# EAGLE schematic electrosteel2020 (EAGLE 9.2.2)
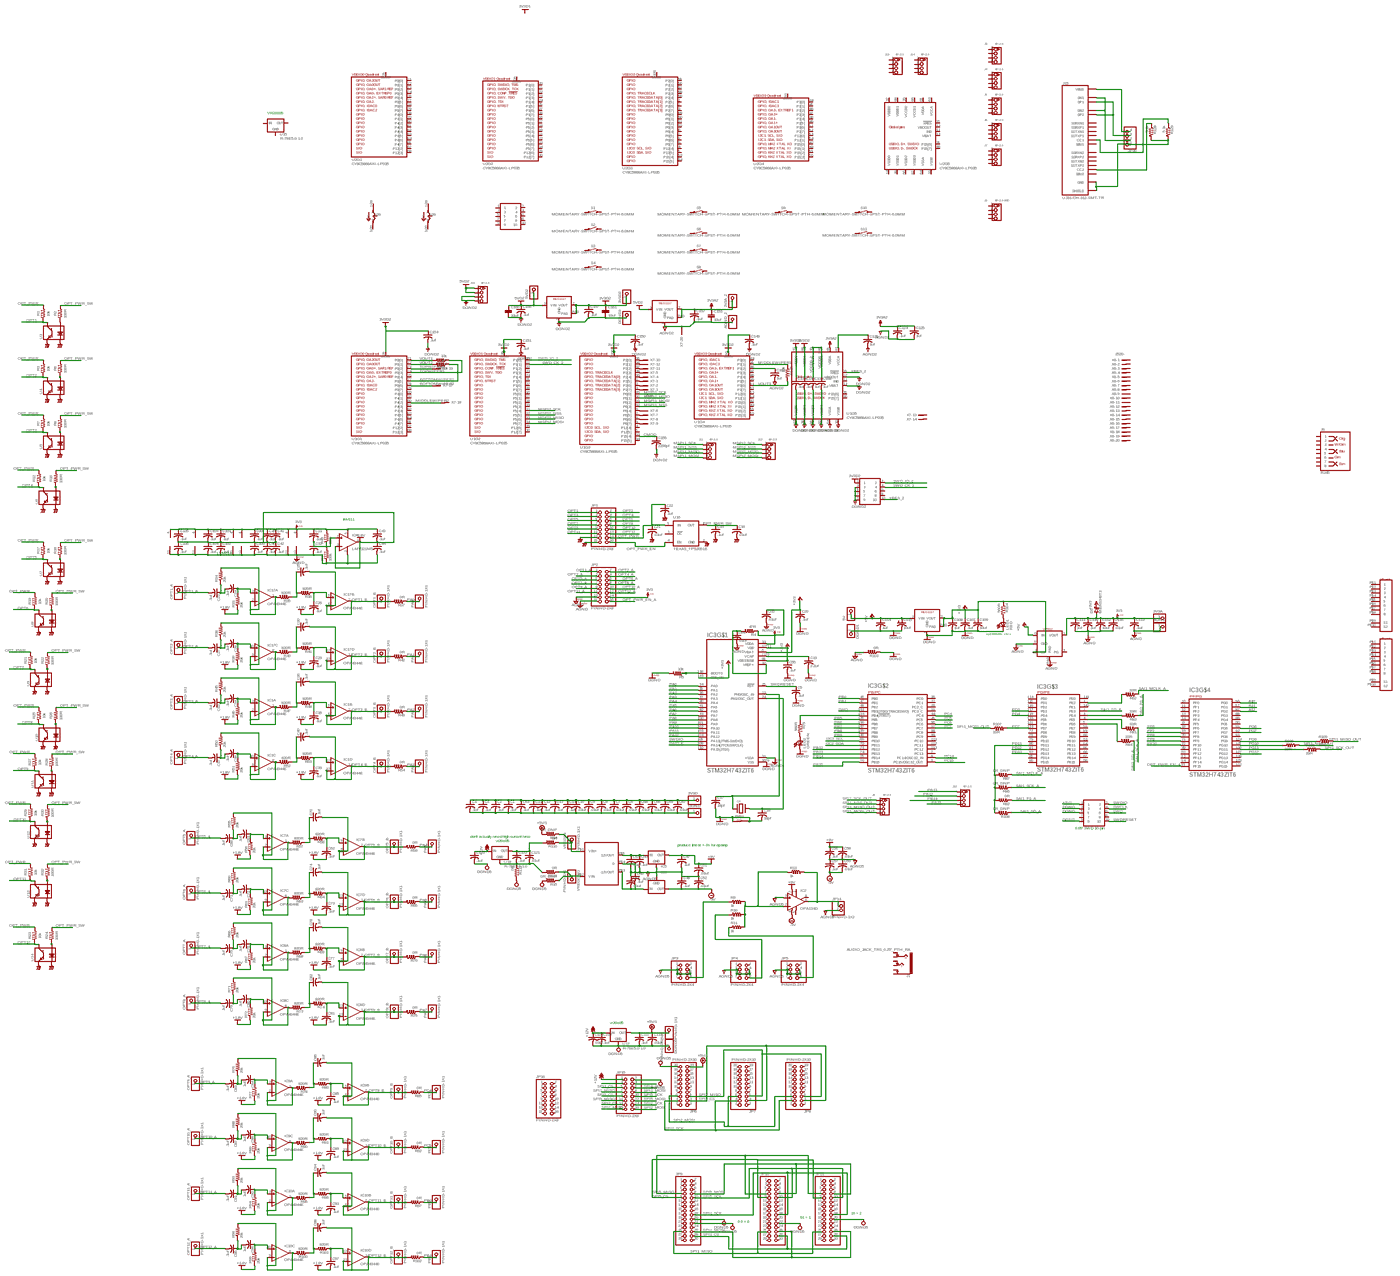
[diagram p0: schematic, sheet 1, overview]
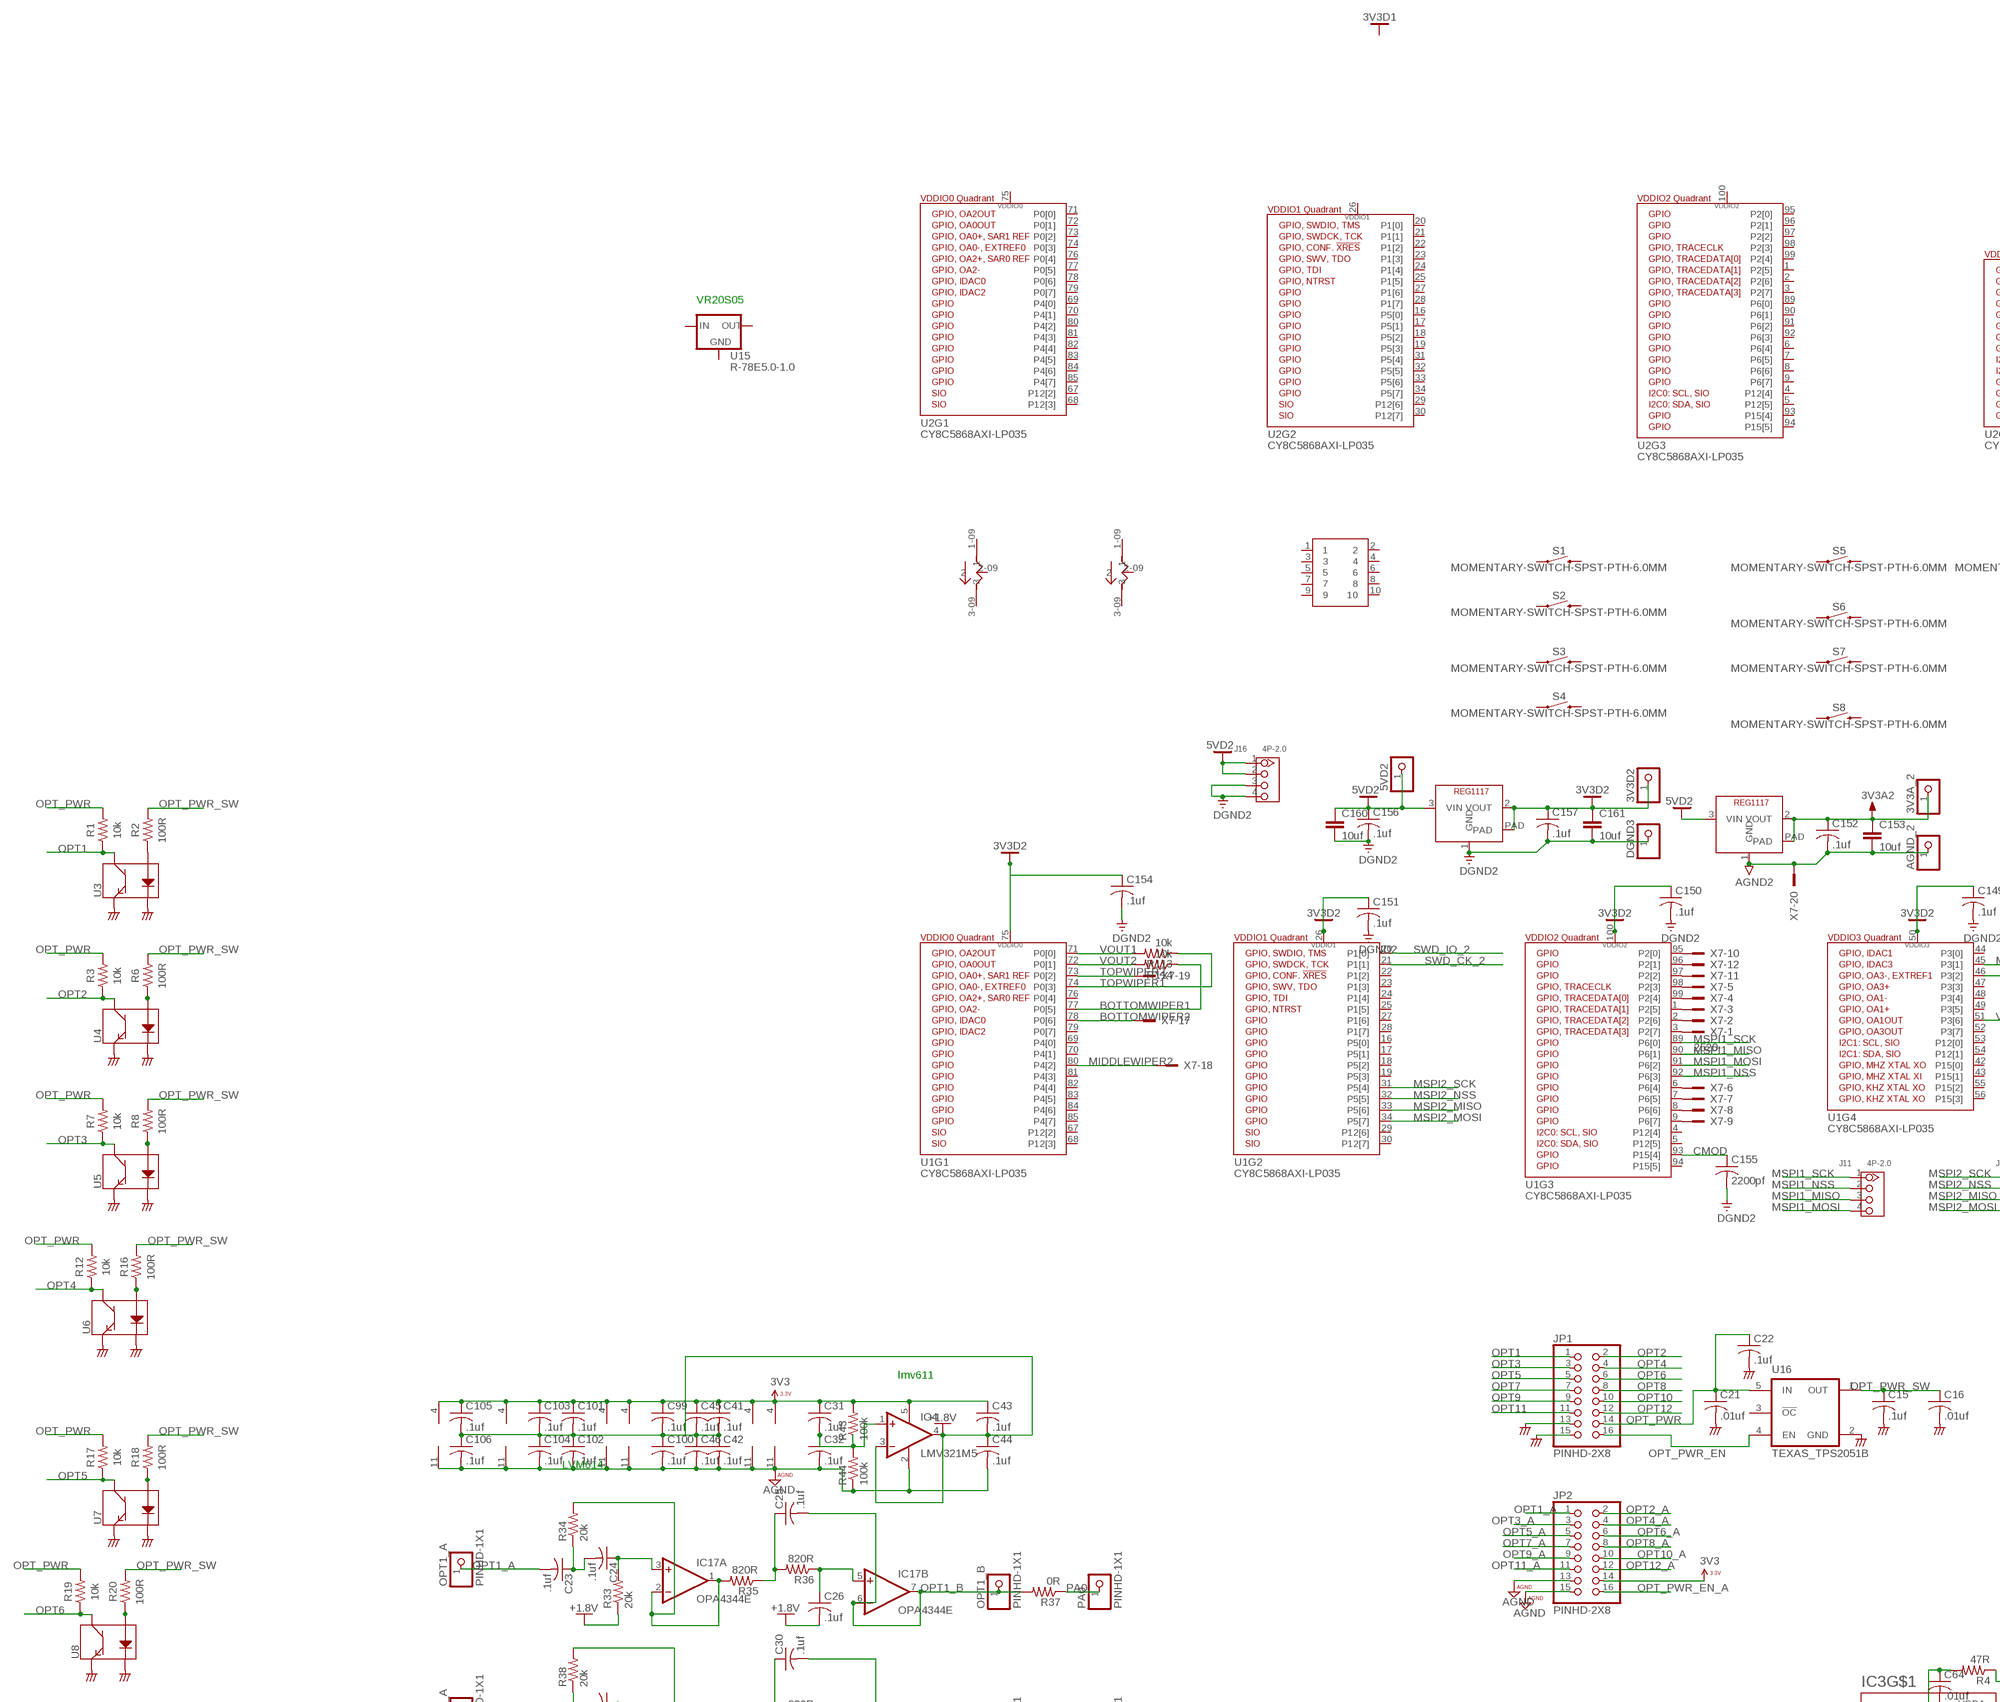
[diagram p1: schematic, sheet 1, part 1 of 4]
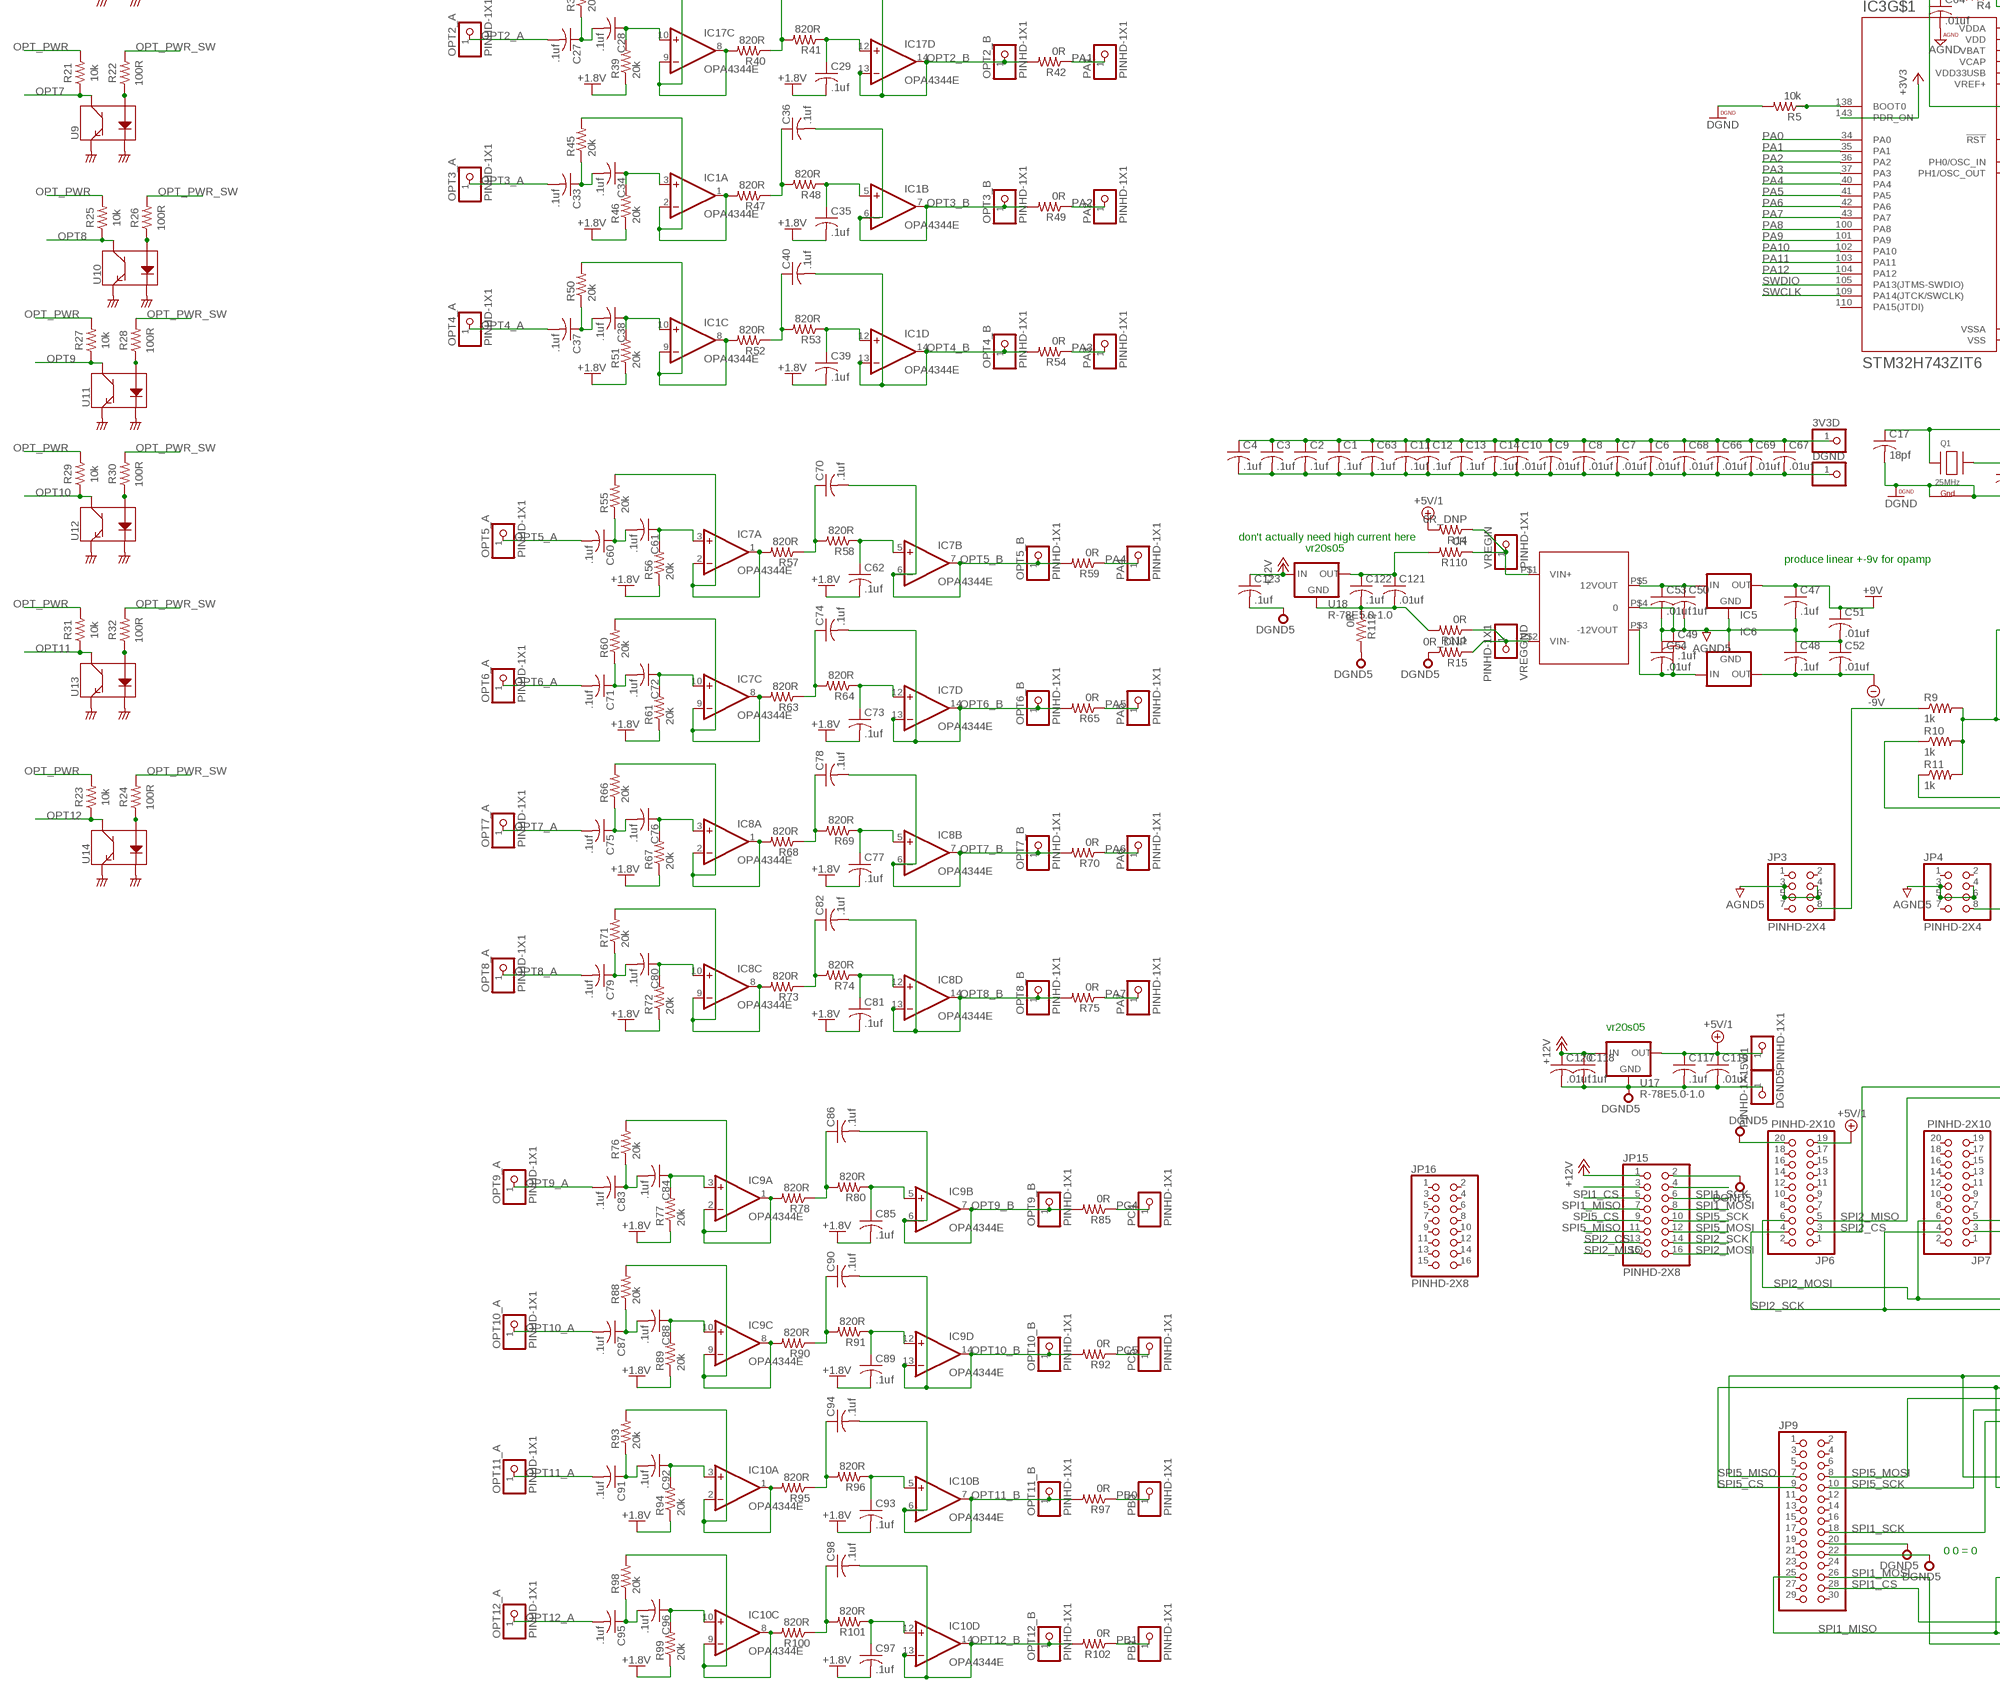
[diagram p2: schematic, sheet 1, part 2 of 4]
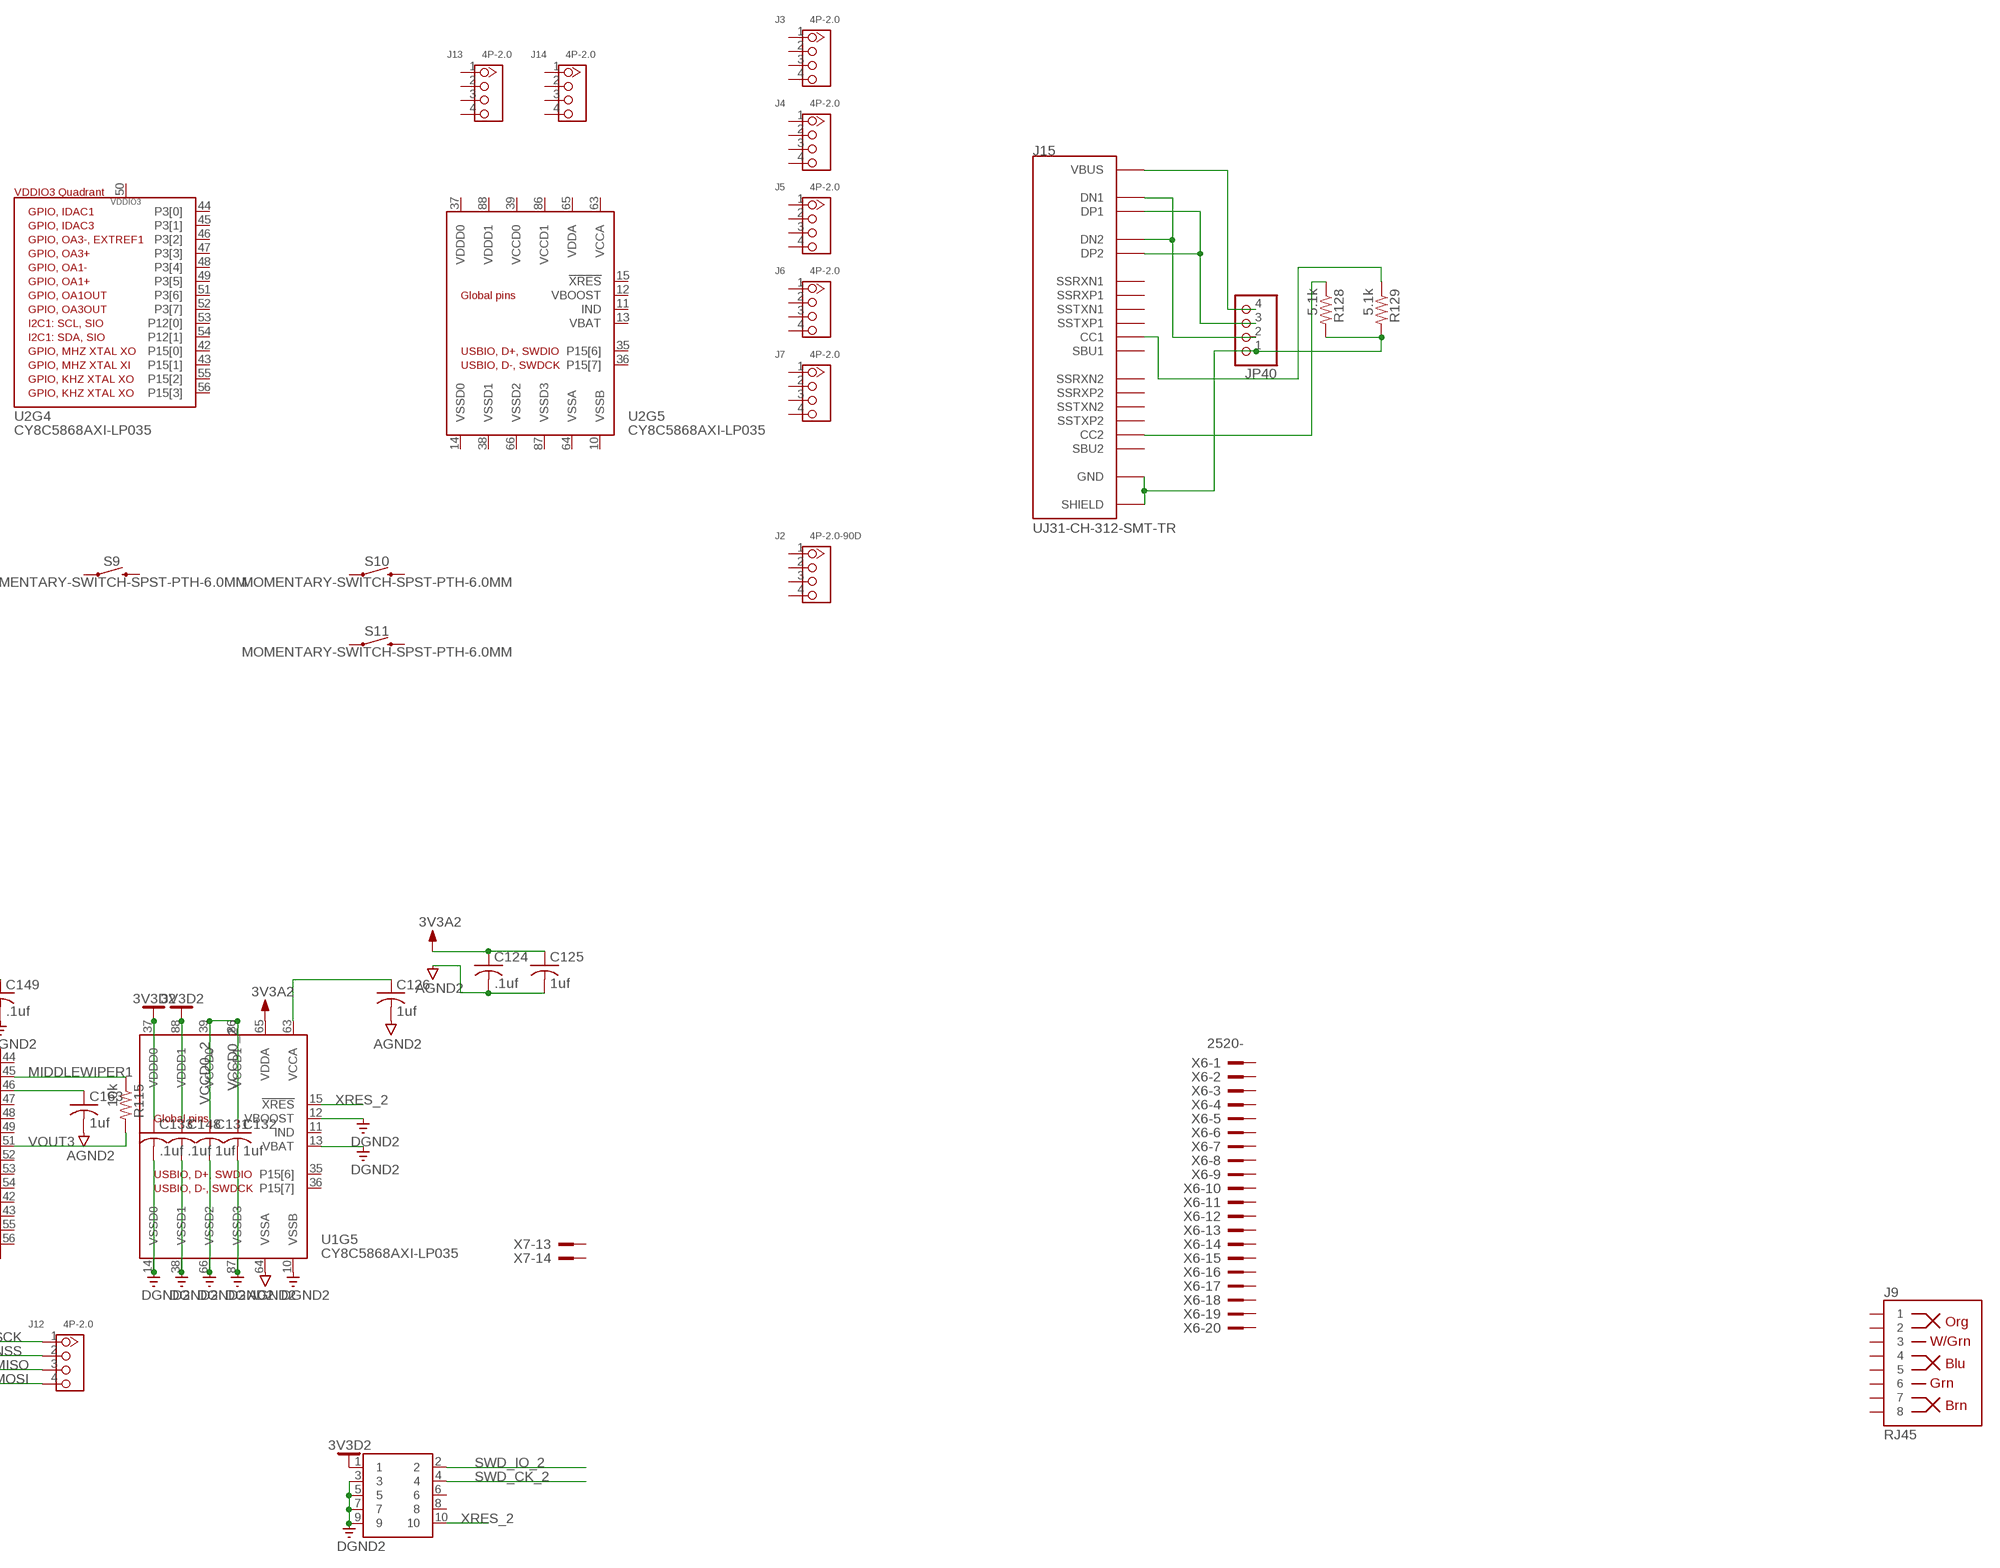
[diagram p3: schematic, sheet 1, part 3 of 4]
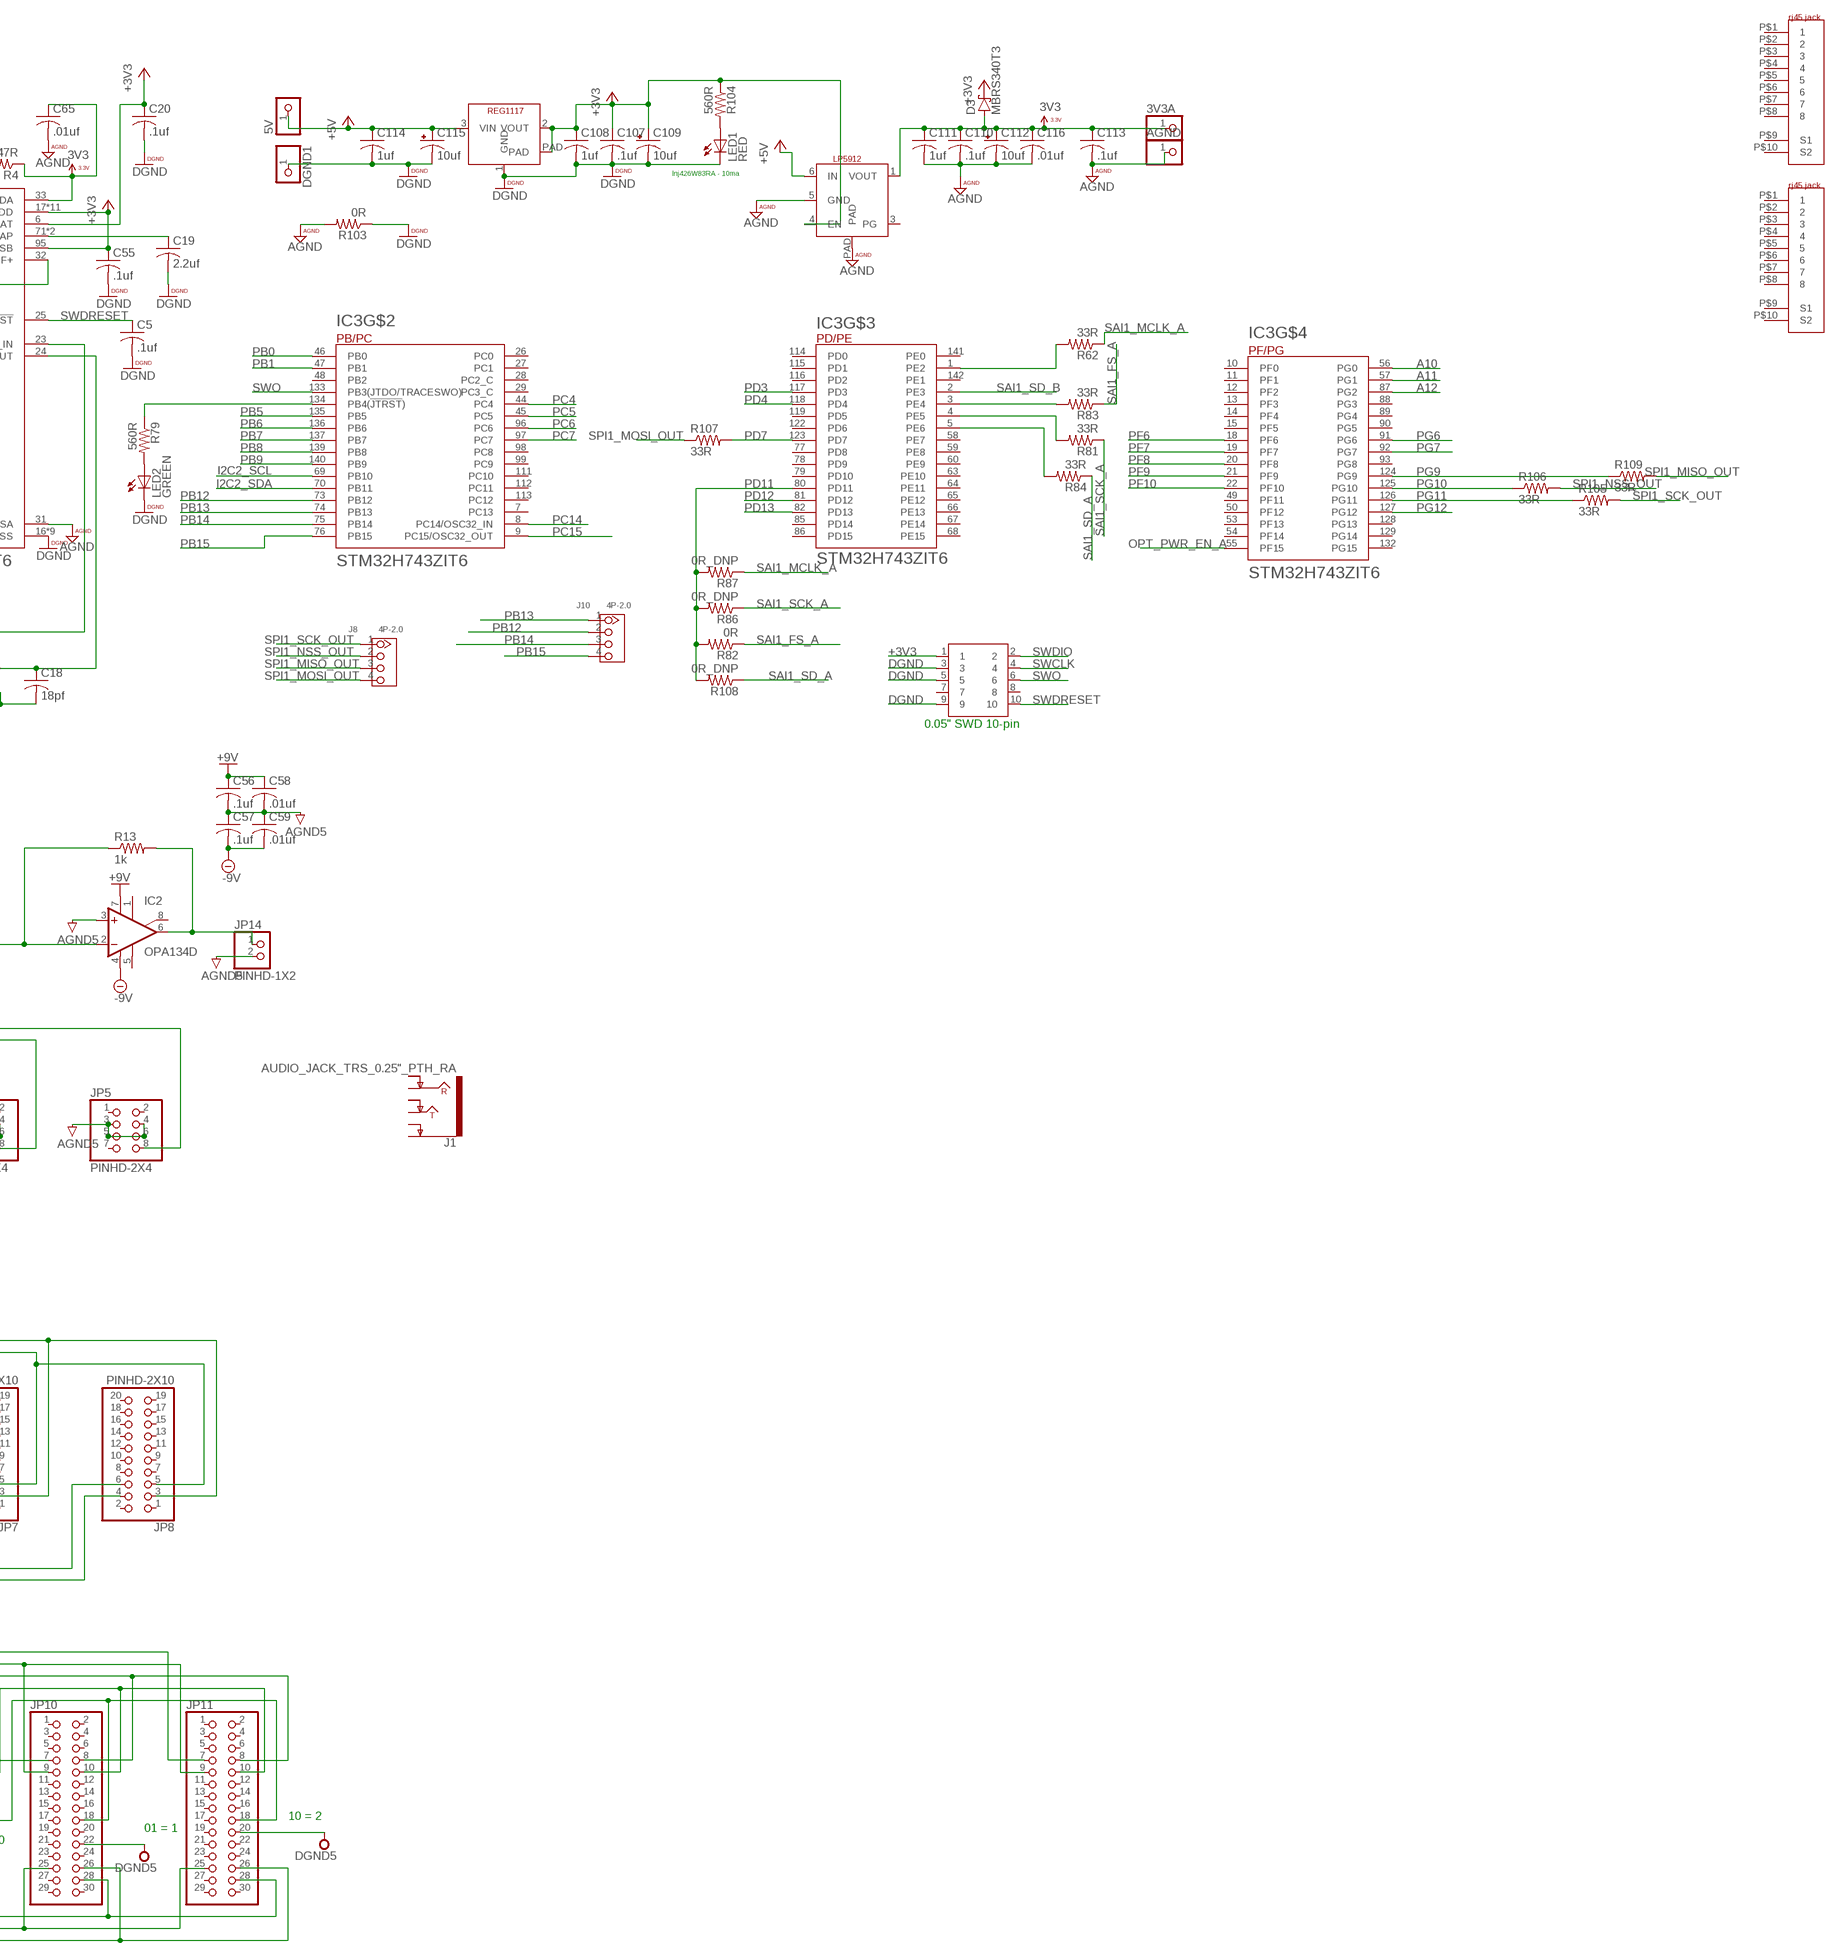
[diagram p4: schematic, sheet 1, part 4 of 4]

## Parts
3V3A  PINHD-1X1  [1X01]
3V3A_2  PINHD-1X1  [1X01]
3V3D  PINHD-1X1  [1X01]
3V3D2  PINHD-1X1  [1X01]
5V  PINHD-1X1  [1X01]
5V/1  PINHD-1X1  [1X01]
5VD2  PINHD-1X1  [1X01]
AGND  PINHD-1X1  [1X01]
AGND_2  PINHD-1X1  [1X01]
C1  .1uf  C-USC0402  [C0402]
C2  .1uf  C-USC0402  [C0402]
C3  .1uf  C-USC0402  [C0402]
C4  .1uf  C-USC0402  [C0402]
C5  .1uf  C-USC0402  [C0402]
C6  .01uf  C-USC0201  [C0201]
C7  .01uf  C-USC0201  [C0201]
C8  .01uf  C-USC0201  [C0201]
C9  .01uf  C-USC0201  [C0201]
C10  .01uf  C-USC0201  [C0201]
C11  .1uf  C-USC0402  [C0402]
C12  .1uf  C-USC0402  [C0402]
C13  .1uf  C-USC0402  [C0402]
C14  .1uf  C-USC0402  [C0402]
C15  .1uf  C-USC0402  [C0402]
C16  .01uf  C-USC0402  [C0402]
C17  18pf  C-USC0603  [C0603]
C18  18pf  C-USC0603  [C0603]
C19  2.2uf  C-USC1206  [C1206]
C20  .1uf  C-USC0402  [C0402]
C21  .01uf  C-USC0402  [C0402]
C22  .1uf  C-USC0402  [C0402]
C23  .1uf  C-USC0402  [C0402]
C24  .1uf  C-USC0402  [C0402]
C25  .1uf  C-USC0402  [C0402]
C26  .1uf  C-USC0402  [C0402]
C27  .1uf  C-USC0402  [C0402]
C28  .1uf  C-USC0402  [C0402]
C29  .1uf  C-USC0402  [C0402]
C30  .1uf  C-USC0402  [C0402]
C31  .1uf  C-USC0402  [C0402]
C32  .1uf  C-USC0402  [C0402]
C33  .1uf  C-USC0402  [C0402]
C34  .1uf  C-USC0402  [C0402]
C35  .1uf  C-USC0402  [C0402]
C36  .1uf  C-USC0402  [C0402]
C37  .1uf  C-USC0402  [C0402]
C38  .1uf  C-USC0402  [C0402]
C39  .1uf  C-USC0402  [C0402]
C40  .1uf  C-USC0402  [C0402]
C41  .1uf  C-USC0402  [C0402]
C42  .1uf  C-USC0402  [C0402]
C43  .1uf  C-USC0402  [C0402]
C44  .1uf  C-USC0402  [C0402]
C45  .1uf  C-USC0402  [C0402]
C46  .1uf  C-USC0402  [C0402]
C47  .1uf  C-USC0402  [C0402]
C48  .1uf  C-USC0402  [C0402]
C49  .1uf  C-USC0402  [C0402]
C50  .1uf  C-USC0402  [C0402]
C51  .01uf  C-USC0201  [C0201]
C52  .01uf  C-USC0201  [C0201]
C53  .01uf  C-USC0201  [C0201]
C54  .01uf  C-USC0201  [C0201]
C55  .1uf  C-USC0402  [C0402]
C56  .1uf  C-USC0402  [C0402]
C57  .1uf  C-USC0402  [C0402]
C58  .01uf  C-USC0201  [C0201]
C59  .01uf  C-USC0201  [C0201]
C60  .1uf  C-USC0402  [C0402]
C61  .1uf  C-USC0402  [C0402]
C62  .1uf  C-USC0402  [C0402]
C63  .1uf  C-USC0402  [C0402]
C64  .01uf  C-USC0402  [C0402]
C65  .01uf  C-USC0402  [C0402]
C66  .01uf  C-USC0201  [C0201]
C67  .01uf  C-USC0201  [C0201]
C68  .01uf  C-USC0201  [C0201]
C69  .01uf  C-USC0201  [C0201]
C70  .1uf  C-USC0402  [C0402]
C71  .1uf  C-USC0402  [C0402]
C72  .1uf  C-USC0402  [C0402]
C73  .1uf  C-USC0402  [C0402]
C74  .1uf  C-USC0402  [C0402]
C75  .1uf  C-USC0402  [C0402]
C76  .1uf  C-USC0402  [C0402]
C77  .1uf  C-USC0402  [C0402]
C78  .1uf  C-USC0402  [C0402]
C79  .1uf  C-USC0402  [C0402]
C80  .1uf  C-USC0402  [C0402]
C81  .1uf  C-USC0402  [C0402]
C82  .1uf  C-USC0402  [C0402]
C83  .1uf  C-USC0402  [C0402]
C84  .1uf  C-USC0402  [C0402]
C85  .1uf  C-USC0402  [C0402]
C86  .1uf  C-USC0402  [C0402]
C87  .1uf  C-USC0402  [C0402]
C88  .1uf  C-USC0402  [C0402]
C89  .1uf  C-USC0402  [C0402]
C90  .1uf  C-USC0402  [C0402]
C91  .1uf  C-USC0402  [C0402]
C92  .1uf  C-USC0402  [C0402]
C93  .1uf  C-USC0402  [C0402]
C94  .1uf  C-USC0402  [C0402]
C95  .1uf  C-USC0402  [C0402]
C96  .1uf  C-USC0402  [C0402]
C97  .1uf  C-USC0402  [C0402]
C98  .1uf  C-USC0402  [C0402]
C99  .1uf  C-USC0402  [C0402]
C100  .1uf  C-USC0402  [C0402]
C101  .1uf  C-USC0402  [C0402]
C102  .1uf  C-USC0402  [C0402]
C103  .1uf  C-USC0402  [C0402]
C104  .1uf  C-USC0402  [C0402]
C105  .1uf  C-USC0402  [C0402]
C106  .1uf  C-USC0402  [C0402]
C107  .1uf  C-USC0603  [C0603]
C108  1uf  C-USC1206  [C1206]
C109  10uf  CPOL-USSMCB  [SMC_B]
C110  .1uf  C-USC0603  [C0603]
C111  1uf  C-USC1206  [C1206]
C112  10uf  CPOL-USSMCB  [SMC_B]
C113  .1uf  C-USC0402  [C0402]
C114  1uf  C-USC1206  [C1206]
C115  10uf  CPOL-USSMCB  [SMC_B]
C116  .01uf  C-USC0201  [C0201]
C117  .1uf  C-USC0402  [C0402]
C118  .1uf  C-USC0402  [C0402]
C119  .01uf  C-USC0201  [C0201]
C120  .01uf  C-USC0201  [C0201]
C121  .01uf  C-USC0201  [C0201]
C122  .1uf  C-USC0402  [C0402]
C123  .1uf  C-USC0402  [C0402]
C124  .1uf  C-USC0603K  [C0603K]
C125  1uf  C-USC1206K  [C1206K]
C126  1uf  C-USC1206K  [C1206K]
C131  1uf  C-USC1206K  [C1206K]
C132  1uf  C-USC1206K  [C1206K]
C133  .1uf  C-USC0603K  [C0603K]
C148  .1uf  C-USC0603K  [C0603K]
C149  .1uf  C-USC0603K  [C0603K]
C150  .1uf  C-USC0603K  [C0603K]
C151  .1uf  C-USC0603K  [C0603K]
C152  .1uf  C-USC0603K  [C0603K]
C153  10uf  C-EUC1206K  [C1206K]
C154  .1uf  C-USC0603K  [C0603K]
C155  2200pf  C-USC0603K  [C0603K]
C156  .1uf  C-USC0603K  [C0603K]
C157  .1uf  C-USC0603K  [C0603K]
C160  10uf  C-EUC1206K  [C1206K]
C161  10uf  C-EUC1206K  [C1206K]
C163  1uf  C-USC1206K  [C1206K]
D3  MBRS340T3  [SMC]
DGND  PINHD-1X1  [1X01]
DGND1  PINHD-1X1  [1X01]
DGND3  PINHD-1X1  [1X01]
DGND5  PINHD-1X1  [1X01]
IC1  OPA4344E  [TSSOP14]
IC2  OPA134D  [SO08]
IC3  STM32H743ZIT6  [QFP50P2200X2200X160-144N]
IC4  LMV321M5  [SOT23-5]
IC5  78LXX  [78LXX]
IC6  79LXX  [79LXX]
IC7  OPA4344E  [TSSOP14]
IC8  OPA4344E  [TSSOP14]
IC9  OPA4344E  [TSSOP14]
IC10  OPA4344E  [TSSOP14]
IC11  LP5912  [6-WSON]
IC12  REG1117  [SOT223]
IC17  OPA4344E  [TSSOP14]
IC18  REG1117  [SOT223]
IC20  REG1117  [SOT223]
J1  AUDIO_JACK_TRS_0.25"_PTH_RA  [AUDIO_JACK_0.25"_TRS_PTH_RA]
J2  4P-2.0-90D  GROVE-CONNECTOR-DIP-90D(4P-2.0)  [HW4-2.0-90D]
J3  4P-2.0  GROVE-CONNECTOR-DIP(4P-2.0)  [HW4-2.0]
J4  4P-2.0  GROVE-CONNECTOR-DIP(4P-2.0)  [HW4-2.0]
J5  4P-2.0  GROVE-CONNECTOR-DIP(4P-2.0)  [HW4-2.0]
J6  4P-2.0  GROVE-CONNECTOR-DIP(4P-2.0)  [HW4-2.0]
J7  4P-2.0  GROVE-CONNECTOR-DIP(4P-2.0)  [HW4-2.0]
J8  4P-2.0  GROVE-CONNECTOR-DIP(4P-2.0)  [HW4-2.0]
J9  RJ45  RJ45-8  [RJ45-8]
J10  4P-2.0  GROVE-CONNECTOR-DIP(4P-2.0)  [HW4-2.0]
J11  4P-2.0  GROVE-CONNECTOR-DIP(4P-2.0)  [HW4-2.0]
J12  4P-2.0  GROVE-CONNECTOR-DIP(4P-2.0)  [HW4-2.0]
J13  4P-2.0  GROVE-CONNECTOR-DIP(4P-2.0)  [HW4-2.0]
J14  4P-2.0  GROVE-CONNECTOR-DIP(4P-2.0)  [HW4-2.0]
J15  UJ31-CH-312-SMT-TR  [CUI_UJ31-CH-312-SMT-TR]
J16  4P-2.0  GROVE-CONNECTOR-DIP(4P-2.0)  [HW4-2.0]
JP1  PINHD-2X8  [2X08]
JP2  PINHD-2X8  [2X08]
JP3  PINHD-2X4  [2X04]
JP4  PINHD-2X4  [2X04]
JP5  PINHD-2X4  [2X04]
JP6  PINHD-2X10  [2X10]
JP7  PINHD-2X10  [2X10]
JP8  PINHD-2X10  [2X10]
JP9  PINHD-2X15  [2X15]
JP10  PINHD-2X15  [2X15]
JP11  PINHD-2X15  [2X15]
JP14  PINHD-1X2  [1X02]
JP15  PINHD-2X8  [2X08]
JP16  PINHD-2X8  [2X08]
JP40  PINHD-1X4  [1X04]
LED1  RED  LEDCHIP-LED0603  [CHIP-LED0603]
LED2  GREEN  LEDCHIP-LED0603  [CHIP-LED0603]
OPT1_A  PINHD-1X1  [1X01]
OPT1_B  PINHD-1X1  [1X01]
OPT2_A  PINHD-1X1  [1X01]
OPT2_B  PINHD-1X1  [1X01]
OPT3_A  PINHD-1X1  [1X01]
OPT3_B  PINHD-1X1  [1X01]
OPT4_A  PINHD-1X1  [1X01]
OPT4_B  PINHD-1X1  [1X01]
OPT5_A  PINHD-1X1  [1X01]
OPT5_B  PINHD-1X1  [1X01]
OPT6_A  PINHD-1X1  [1X01]
OPT6_B  PINHD-1X1  [1X01]
OPT7_A  PINHD-1X1  [1X01]
OPT7_B  PINHD-1X1  [1X01]
OPT8_A  PINHD-1X1  [1X01]
OPT8_B  PINHD-1X1  [1X01]
OPT9_A  PINHD-1X1  [1X01]
OPT9_B  PINHD-1X1  [1X01]
OPT10_A  PINHD-1X1  [1X01]
OPT10_B  PINHD-1X1  [1X01]
OPT11_A  PINHD-1X1  [1X01]
OPT11_B  PINHD-1X1  [1X01]
OPT12_A  PINHD-1X1  [1X01]
OPT12_B  PINHD-1X1  [1X01]
PA0  PINHD-1X1  [1X01]
PA1  PINHD-1X1  [1X01]
PA2  PINHD-1X1  [1X01]
PA3  PINHD-1X1  [1X01]
PA4  PINHD-1X1  [1X01]
PA5  PINHD-1X1  [1X01]
PA6  PINHD-1X1  [1X01]
PA7  PINHD-1X1  [1X01]
PB0  PINHD-1X1  [1X01]
PB1  PINHD-1X1  [1X01]
PC4  PINHD-1X1  [1X01]
PC5  PINHD-1X1  [1X01]
Q1  25MHz  XTAL-4-3225  [NX3225]
R1  10k  R-US_CHIP-0603(1608-METRIC)  [RESC1608X60]
R2  100R  R-US_CHIP-0603(1608-METRIC)  [RESC1608X60]
R3  10k  R-US_CHIP-0603(1608-METRIC)  [RESC1608X60]
R4  47R  R-US_R0603  [R0603]
R5  10k  R-US_R0402  [R0402]
R6  100R  R-US_CHIP-0603(1608-METRIC)  [RESC1608X60]
R7  10k  R-US_CHIP-0603(1608-METRIC)  [RESC1608X60]
R8  100R  R-US_CHIP-0603(1608-METRIC)  [RESC1608X60]
R9  1k  R-US_R0603  [R0603]
R10  1k  R-US_R0603  [R0603]
R11  1k  R-US_R0603  [R0603]
R12  10k  R-US_CHIP-0603(1608-METRIC)  [RESC1608X60]
R13  1k  R-US_R0603  [R0603]
R14  0R_DNP  R-US_R0603  [R0603]
R15  0R_DNP  R-US_R0603  [R0603]
R16  100R  R-US_CHIP-0603(1608-METRIC)  [RESC1608X60]
R17  10k  R-US_CHIP-0603(1608-METRIC)  [RESC1608X60]
R18  100R  R-US_CHIP-0603(1608-METRIC)  [RESC1608X60]
R19  10k  R-US_CHIP-0603(1608-METRIC)  [RESC1608X60]
R20  100R  R-US_CHIP-0603(1608-METRIC)  [RESC1608X60]
R21  10k  R-US_CHIP-0603(1608-METRIC)  [RESC1608X60]
R22  100R  R-US_CHIP-0603(1608-METRIC)  [RESC1608X60]
R23  10k  R-US_CHIP-0603(1608-METRIC)  [RESC1608X60]
R24  100R  R-US_CHIP-0603(1608-METRIC)  [RESC1608X60]
R25  10k  R-US_CHIP-0603(1608-METRIC)  [RESC1608X60]
R26  100R  R-US_CHIP-0603(1608-METRIC)  [RESC1608X60]
R27  10k  R-US_CHIP-0603(1608-METRIC)  [RESC1608X60]
R28  100R  R-US_CHIP-0603(1608-METRIC)  [RESC1608X60]
R29  10k  R-US_CHIP-0603(1608-METRIC)  [RESC1608X60]
R30  100R  R-US_CHIP-0603(1608-METRIC)  [RESC1608X60]
R31  10k  R-US_CHIP-0603(1608-METRIC)  [RESC1608X60]
R32  100R  R-US_CHIP-0603(1608-METRIC)  [RESC1608X60]
R33  20k  R-US_R0603  [R0603]
R34  20k  R-US_R0603  [R0603]
R35  820R  R-US_R0603  [R0603]
R36  820R  R-US_R0603  [R0603]
R37  0R  R-US_R0603  [R0603]
R38  20k  R-US_R0603  [R0603]
R39  20k  R-US_R0603  [R0603]
R40  820R  R-US_R0603  [R0603]
R41  820R  R-US_R0603  [R0603]
R42  0R  R-US_R0603  [R0603]
R43  100k  R-US_R0603  [R0603]
R44  100k  R-US_R0603  [R0603]
R45  20k  R-US_R0603  [R0603]
R46  20k  R-US_R0603  [R0603]
R47  820R  R-US_R0603  [R0603]
R48  820R  R-US_R0603  [R0603]
R49  0R  R-US_R0603  [R0603]
R50  20k  R-US_R0603  [R0603]
R51  20k  R-US_R0603  [R0603]
R52  820R  R-US_R0603  [R0603]
R53  820R  R-US_R0603  [R0603]
R54  0R  R-US_R0603  [R0603]
R55  20k  R-US_R0603  [R0603]
R56  20k  R-US_R0603  [R0603]
R57  820R  R-US_R0603  [R0603]
R58  820R  R-US_R0603  [R0603]
R59  0R  R-US_R0603  [R0603]
R60  20k  R-US_R0603  [R0603]
R61  20k  R-US_R0603  [R0603]
R62  33R  R-US_R0201  [R0201]
R63  820R  R-US_R0603  [R0603]
R64  820R  R-US_R0603  [R0603]
R65  0R  R-US_R0603  [R0603]
R66  20k  R-US_R0603  [R0603]
R67  20k  R-US_R0603  [R0603]
R68  820R  R-US_R0603  [R0603]
R69  820R  R-US_R0603  [R0603]
R70  0R  R-US_R0603  [R0603]
R71  20k  R-US_R0603  [R0603]
R72  20k  R-US_R0603  [R0603]
R73  820R  R-US_R0603  [R0603]
R74  820R  R-US_R0603  [R0603]
R75  0R  R-US_R0603  [R0603]
R76  20k  R-US_R0603  [R0603]
R77  20k  R-US_R0603  [R0603]
R78  820R  R-US_R0603  [R0603]
R79  560R  R-US_R0603  [R0603]
R80  820R  R-US_R0603  [R0603]
R81  33R  R-US_R0201  [R0201]
R82  0R  R-US_R0603  [R0603]
R83  33R  R-US_R0201  [R0201]
R84  33R  R-US_R0201  [R0201]
R85  0R  R-US_R0603  [R0603]
R86  0R_DNP  R-US_R0603  [R0603]
R87  0R_DNP  R-US_R0603  [R0603]
R88  20k  R-US_R0603  [R0603]
R89  20k  R-US_R0603  [R0603]
R90  820R  R-US_R0603  [R0603]
R91  820R  R-US_R0603  [R0603]
R92  0R  R-US_R0603  [R0603]
R93  20k  R-US_R0603  [R0603]
R94  20k  R-US_R0603  [R0603]
R95  820R  R-US_R0603  [R0603]
R96  820R  R-US_R0603  [R0603]
R97  0R  R-US_R0603  [R0603]
R98  20k  R-US_R0603  [R0603]
R99  20k  R-US_R0603  [R0603]
R100  820R  R-US_R0603  [R0603]
R101  820R  R-US_R0603  [R0603]
R102  0R  R-US_R0603  [R0603]
R103  0R  R-US_R0603  [R0603]
R104  560R  R-US_R0603  [R0603]
R105  33R  R-US_R0402  [R0402]
R106  33R  R-US_R0402  [R0402]
R107  33R  R-US_R0402  [R0402]
R108  0R_DNP  R-US_R0603  [R0603]
R109  33R  R-US_R0402  [R0402]
R110  0R  R-US_R0603  [R0603]
R111  0R  R-US_R0603  [R0603]
R112  0R  R-US_R0603  [R0603]
R113  10k  R-US_R0603  [R0603]
R114  10k  R-US_R0603  [R0603]
R115  10k  R-US_R0603  [R0603]
R128  5.1k  R-US_R0603  [R0603]
R129  5.1k  R-US_R0603  [R0603]
S1  MOMENTARY-SWITCH-SPST-PTH-6.0MM  [TACTILE_SWITCH_PTH_6.0MM]
S2  MOMENTARY-SWITCH-SPST-PTH-6.0MM  [TACTILE_SWITCH_PTH_6.0MM]
S3  MOMENTARY-SWITCH-SPST-PTH-6.0MM  [TACTILE_SWITCH_PTH_6.0MM]
S4  MOMENTARY-SWITCH-SPST-PTH-6.0MM  [TACTILE_SWITCH_PTH_6.0MM]
S5  MOMENTARY-SWITCH-SPST-PTH-6.0MM  [TACTILE_SWITCH_PTH_6.0MM]
S6  MOMENTARY-SWITCH-SPST-PTH-6.0MM  [TACTILE_SWITCH_PTH_6.0MM]
S7  MOMENTARY-SWITCH-SPST-PTH-6.0MM  [TACTILE_SWITCH_PTH_6.0MM]
S8  MOMENTARY-SWITCH-SPST-PTH-6.0MM  [TACTILE_SWITCH_PTH_6.0MM]
S9  MOMENTARY-SWITCH-SPST-PTH-6.0MM  [TACTILE_SWITCH_PTH_6.0MM]
S10  MOMENTARY-SWITCH-SPST-PTH-6.0MM  [TACTILE_SWITCH_PTH_6.0MM]
S11  MOMENTARY-SWITCH-SPST-PTH-6.0MM  [TACTILE_SWITCH_PTH_6.0MM]
U1  CY8C5868AXI-LP035  PSOC_5LP_100QFP  [TQFP-100-14X14MM]
U2  CY8C5868AXI-LP035  PSOC_5LP_100QFP  [TQFP-100-14X14MM]
U3  QRE1113  [QRE1113]
U4  QRE1113  [QRE1113]
U5  QRE1113  [QRE1113]
U6  QRE1113  [QRE1113]
U7  QRE1113  [QRE1113]
U8  QRE1113  [QRE1113]
U9  QRE1113  [QRE1113]
U10  QRE1113  [QRE1113]
U11  QRE1113  [QRE1113]
U12  QRE1113  [QRE1113]
U13  QRE1113  [QRE1113]
U14  QRE1113  [QRE1113]
U15  R-78E5.0-1.0  [DC-DC_CONVERTER_78XX]
U16  TEXAS_TPS2051B  [TEXAS_SOT23-5]
U17  R-78E5.0-1.0  [DC-DC_CONVERTER_78XX]
U18  R-78E5.0-1.0  [DC-DC_CONVERTER_78XX]
U$1  RK09  [RK09]
U$2  RK09  [RK09]
U$3  CMR0512S3C  [CMR0512S3C]
U$5  SS-7188VS-A-FLS  [SS-7188VS-A-FLS_RJ45]
U$6  SS-7188VS-A-FLS  [SS-7188VS-A-FLS_RJ45]
VREGGND  PINHD-1X1  [1X01]
VREGIN  PINHD-1X1  [1X01]
X1  3221-10-0300-00  [3221-10-0300-00]
X2  3221-10-0300-00  [3221-10-0300-00]
X3  3221-10-0300-00  [3221-10-0300-00]
X6  2520-  [PAK100/2500-20]
X7  2520-  [PAK100/2500-20]

## Nets
3V3: C31.1 C41.1 C43.1 C45.1 C99.1 C101.1 C103.1 C105.1 IC1.4(P:V+) IC4.5(V+) IC7.4(P:V+) IC8.4(P:V+) IC9.4(P:V+) IC10.4(P:V+) IC17.4(P:V+) JP2.14 R43.2
3V3A: 3V3A.1 C65.1 C110.1 C111.1 C112.+ C113.1 C116.1 D3.A IC3.33(VDDA) IC11.1(VOUT) R4.1 ; supply symbol labelled 3V3
3V3A2: 3V3A_2.1 C124.1 C125.1 C152.1 C153.1 IC18.2(VOUT) IC18.PAD U1.65(VDDA)
3V3D2: 3V3D2.1 C133.1 C148.1 C149.1 C150.1 C151.1 C154.1 C157.1 C161.1 IC20.2(VOUT) IC20.PAD U1.26(VDDIO1) U1.37(VDDD0) U1.50(VDDIO3) U1.75(VDDIO0) U1.88(VDDD1) U1.100(VDDIO2) X3.1
5VD2: 5VD2.1 C156.1 C160.1 IC18.3(VIN) IC20.3(VIN) J16.1 J16.2
+1.8V: C26.2 C29.2 C35.2 C39.2 C41.2 C42.1 C43.2 C44.1 C45.2 C46.1 C62.2 C73.2 C77.2 C81.2 C85.2 C89.2 C93.2 C97.2 C99.2 C100.1 C101.2 C102.1 C103.2 C104.1 C105.2 C106.1 IC4.3(-IN) IC4.4(OUT) R33.1 R39.1 R46.1 R51.1 R56.1 R61.1 R67.1 R72.1 R77.1 R89.1 R94.1 R99.1
+3V3: 3V3D.1 C1.1 C2.1 C3.1 C4.1 C6.1 C7.1 C8.1 C9.1 C10.1 C11.1 C12.1 C13.1 C14.1 C20.1 C55.1 C63.1 C66.1 C67.1 C68.1 C69.1 C107.1 C108.1 C109.+ D3.C IC3.6(VBAT) IC3.17(VDD) IC3.30(VDD) IC3.39(VDD) IC3.52(VDD) IC3.62(VDD) IC3.72(VDD) IC3.84(VDD) IC3.95(VDD33USB) IC3.108(VDD) IC3.121(VDD) IC3.131(VDD) IC3.143(PDR_ON) IC3.144(VDD) IC11.4(EN) IC12.2(VOUT) IC12.PAD R104.1 X2.1
+5V: 5V.1 C114.1 C115.+ IC11.6(IN) IC12.3(VIN)
+5V/1: 5V/1.1 C117.1 C119.1 JP6.19 R14.2 U17.VOUT(OUT)
+9V: C47.1 C51.1 C56.1 C58.1 IC2.7(V+) IC5.OUT
+12V: C118.1 C120.1 C123.1 JP15.1 U17.VIN(IN) U18.VIN(IN)
-9V: C48.2 C52.2 C57.2 C59.2 IC2.4(V-) IC6.OUT
A10: IC3.56(PG0)
A11: IC3.57(PG1)
A12: IC3.87(PG2)
AGND: AGND.1 C32.2 C42.2 C44.2 C46.2 C64.2 C65.2 C100.2 C102.2 C104.2 C106.2 C110.2 C111.2 C112.- C113.2 C116.2 IC1.11(P:V-) IC3.31(VSSA) IC4.2(V-) IC7.11(P:V-) IC8.11(P:V-) IC9.11(P:V-) IC10.11(P:V-) IC11.5(GND) IC11.PAD IC17.11(P:V-) JP2.13 JP2.15 R44.1 R103.2
AGND2: AGND_2.1 C124.2 C125.2 C126.2 C152.2 C153.2 C163.2 IC18.1(GND) U1.64(VSSA) X7.20
AGND5: C47.2 C48.1 C49.1 C50.2 C51.2 C52.1 C53.2 C54.1 C56.2 C57.1 C58.2 C59.1 IC2.3(+IN) IC5.GND IC6.GND JP3.3 JP3.4 JP3.5 JP3.6 JP4.3 JP4.4 JP4.5 JP4.6 JP5.3 JP5.4 JP5.5 JP5.6 JP14.2 U$3.P$4
BOTTOMWIPER1: R114.1 U1.77(P0[5])
BOTTOMWIPER2: U1.78(P0[6]) X7.17
CGND: C15.2 C16.2 C21.2 C22.2 JP1.13 JP1.15 U3.2(K) U3.4(E) U4.2(K) U4.4(E) U5.2(K) U5.4(E) U6.2(K) U6.4(E) U7.2(K) U7.4(E) U8.2(K) U8.4(E) U9.2(K) U9.4(E) U10.2(K) U10.4(E) U11.2(K) U11.4(E) U12.2(K) U12.4(E) U13.2(K) U13.4(E) U14.2(K) U14.4(E) U16.2(GND) ; supply symbol labelled SUPPLY0_CGND_
CMOD: C155.1 U1.93(P15[4])
DGND: C1.2 C2.2 C3.2 C4.2 C5.2 C6.2 C7.2 C8.2 C9.2 C10.2 C11.2 C12.2 C13.2 C14.2 C17.2 C18.2 C19.2 C20.2 C55.2 C63.2 C66.2 C67.2 C68.2 C69.2 C107.2 C108.2 C109.- C114.2 C115.- DGND1.1 DGND.1 IC3.16(VSS) IC3.38(VSS) IC3.51(VSS) IC3.61(VSS) IC3.83(VSS) IC3.94(VSS) IC3.107(VSS) IC3.120(VSS) IC3.130(VSS) IC12.1(GND) LED1.C LED2.C Q1.2(G2) Q1.4(G1) R5.2 R103.1 X2.3 X2.5 X2.9
DGND2: C131.2 C132.2 C133.2 C148.2 C149.2 C150.2 C151.2 C154.2 C155.2 C156.2 C157.2 C160.2 C161.2 DGND3.1 IC20.1(GND) J16.3 J16.4 U1.10(VSSB) U1.12(VBOOST) U1.13(VBAT) U1.14(VSSD0) U1.38(VSSD1) U1.66(VSSD2) U1.87(VSSD3) X3.3 X3.5 X3.7 X3.9
DGND5: C117.2 C118.2 C119.2 C120.2 C123.2 DGND5.1 JP6.20 JP9.20 JP9.22 JP10.22 JP11.20 JP15.2 R15.2 R112.2 U17.GND
GND_USBC: J15.A1(GND) J15.A12(GND) J15.B1(GND) J15.B12(GND) J15.SH1(SHIELD) J15.SH2(SHIELD) J15.SH3(SHIELD) J15.SH4(SHIELD) J15.SH5(SHIELD) J15.SH6(SHIELD) J15.SH7(SHIELD) J15.SH8(SHIELD) JP40.1 R128.2 R129.2
I2C2_SCL: IC3.69(PB10)
I2C2_SDA: IC3.70(PB11)
MIDDLEWIPER1: R115.1 U1.45(P3[1])
MIDDLEWIPER2: U1.80(P4[2]) X7.18
MSPI1_MISO: J11.3 U1.90(P6[1])
MSPI1_MOSI: J11.4 U1.91(P6[2])
MSPI1_NSS: J11.2 U1.92(P6[3])
MSPI1_SCK: J11.1 U1.89(P6[0])
MSPI2_MISO: J12.3 U1.33(P5[6])
MSPI2_MOSI: J12.4 U1.34(P5[7])
MSPI2_NSS: J12.2 U1.32(P5[5])
MSPI2_SCK: J12.1 U1.31(P5[4])
N$1: R6.1 U4.1(A)
N$2: R2.1 U3.1(A)
N$3: C121.1 C122.1 R110.2 U18.VOUT(OUT)
N$4: C121.2 C122.2 R111.2 R112.1 U18.GND
N$5: LED2.A R79.2
N$6: IC3.134(PB4(!JTRST!)) R79.1
N$7: R8.1 U5.1(A)
N$8: IC3.4(PE5) R81.2
N$9: U1.3(P2[7]) X7.1
N$13: IC3.3(PE4) R83.2
N$17: IC3.5(PE6) R84.2
N$19: IC3.1(PE2) R62.2
N$24: U1.2(P2[6]) X7.2
N$25: U1.1(P2[5]) X7.3
N$26: JP3.8 R9.1
N$27: JP4.8 R10.1
N$28: JP5.8 R11.1
N$29: IC2.2(-IN) R9.2 R10.2 R11.2 R13.1
N$30: C50.1 C53.1 IC5.IN U$3.P$5(12VOUT)
N$31: C60.1 C61.2 R55.1
N$32: IC2.6(OUT) JP14.1 R13.2
N$33: R16.1 U6.1(A)
N$34: C49.2 C54.2 IC6.IN U$3.P$3(-12VOUT)
N$35: R18.1 U7.1(A)
N$36: R20.1 U8.1(A)
N$37: R22.1 U9.1(A)
N$38: R24.1 U14.1(A)
N$39: R26.1 U10.1(A)
N$40: R28.1 U11.1(A)
N$41: R30.1 U12.1(A)
N$42: R32.1 U13.1(A)
N$43: C27.1 C28.2 R38.1
N$44: IC3.138(BOOT0) R5.1
N$45: C28.1 IC17.10(C:+IN) R39.2
N$46: IC17.8(C:OUT) IC17.9(C:-IN) R38.2 R40.2
N$47: C29.1 IC17.12(D:+IN) R41.1
N$48: C30.1 R40.1 R41.2
N$49: C33.1 C34.2 R45.1
N$50: C34.1 IC1.3(A:+IN) R46.2
N$51: IC1.1(A:OUT) IC1.2(A:-IN) R45.2 R47.2
N$52: C35.1 IC1.5(B:+IN) R48.1
N$53: C36.1 R47.1 R48.2
N$54: C37.1 C38.2 R50.1
N$55: C38.1 IC1.10(C:+IN) R51.2
N$56: IC1.8(C:OUT) IC1.9(C:-IN) R50.2 R52.2
N$57: C39.1 IC1.12(D:+IN) R53.1
N$58: C40.1 R52.1 R53.2
N$59: C61.1 IC7.3(A:+IN) R56.2
N$60: IC7.1(A:OUT) IC7.2(A:-IN) R55.2 R57.2
N$61: LED1.A R104.2
N$62: C62.1 IC7.5(B:+IN) R58.1
N$63: C70.1 R57.1 R58.2
N$64: C71.1 C72.2 R60.1
N$65: C72.1 IC7.10(C:+IN) R61.2
N$66: IC7.8(C:OUT) IC7.9(C:-IN) R60.2 R63.2
N$67: C73.1 IC7.12(D:+IN) R64.1
N$68: C23.1 C24.2 R34.1
N$69: C24.1 IC17.3(A:+IN) R33.2
N$70: C74.1 R63.1 R64.2
N$71: IC17.1(A:OUT) IC17.2(A:-IN) R34.2 R35.2
N$72: C26.1 IC17.5(B:+IN) R36.1
N$73: C25.1 R35.1 R36.2
N$74: C75.1 C76.2 R66.1
N$75: C76.1 IC8.3(A:+IN) R67.2
N$76: IC8.1(A:OUT) IC8.2(A:-IN) R66.2 R68.2
N$77: C77.1 IC8.5(B:+IN) R69.1
N$78: C78.1 R68.1 R69.2
N$79: C79.1 C80.2 R71.1
N$80: C80.1 IC8.10(C:+IN) R72.2
N$81: IC8.8(C:OUT) IC8.9(C:-IN) R71.2 R73.2
N$82: C81.1 IC8.12(D:+IN) R74.1
N$83: C82.1 R73.1 R74.2
N$84: C83.1 C84.2 R76.1
N$85: C84.1 IC9.3(A:+IN) R77.2
N$86: IC9.1(A:OUT) IC9.2(A:-IN) R76.2 R78.2
N$87: C85.1 IC9.5(B:+IN) R80.1
N$88: C86.1 R78.1 R80.2
N$89: C87.1 C88.2 R88.1
N$90: C88.1 IC9.10(C:+IN) R89.2
N$91: IC9.8(C:OUT) IC9.9(C:-IN) R88.2 R90.2
N$92: C89.1 IC9.12(D:+IN) R91.1
N$93: C90.1 R90.1 R91.2
N$94: C91.1 C92.2 R93.1
N$95: C92.1 IC10.3(A:+IN) R94.2
N$96: IC10.1(A:OUT) IC10.2(A:-IN) R93.2 R95.2
N$97: C93.1 IC10.5(B:+IN) R96.1
N$98: C94.1 R95.1 R96.2
N$99: C95.1 C96.2 R98.1
N$100: C96.1 IC10.10(C:+IN) R99.2
N$101: IC10.8(C:OUT) IC10.9(C:-IN) R98.2 R100.2
N$102: C97.1 IC10.12(D:+IN) R101.1
N$103: C98.1 R100.1 R101.2
N$104: C31.2 C32.1 IC4.1(+IN) R43.1 R44.2
N$105: R15.1 R111.1 U$3.P$2(VIN-) VREGGND.1
N$106: R14.1 R110.1 U$3.P$1(VIN+) VREGIN.1
N$107: U1.99(P2[4]) X7.4
N$108: U1.98(P2[3]) X7.5
N$109: U1.6(P6[4]) X7.6
N$110: U1.7(P6[5]) X7.7
N$111: C126.1 U1.63(VCCA)
N$112: U1.8(P6[6]) X7.8
N$113: U1.97(P2[2]) X7.11
N$114: U1.9(P6[7]) X7.9
N$115: U1.95(P2[0]) X7.10
N$116: C163.1 U1.46(P3[2])
N$117: JP15.4
N$118: JP15.3
N$119: U1.96(P2[1]) X7.12
N$186: J15.A4(VBUS) J15.A9(VBUS) J15.B4(VBUS) J15.B9(VBUS) JP40.4
N$188: J15.B5(CC2) R128.1
N$189: J15.A5(CC1) R129.1
N$191: J15.A6(DP1) J15.B6(DP2) JP40.3
N$192: J15.A7(DN1) J15.B7(DN2) JP40.2
OPT1: JP1.1 R1.1 U3.3(C)
OPT1_A: C23.2 JP2.1 OPT1_A.1
OPT1_B: C25.2 IC17.6(B:-IN) IC17.7(B:OUT) OPT1_B.1 R37.2
OPT2: JP1.2 R3.1 U4.3(C)
OPT2_A: C27.2 JP2.2 OPT2_A.1
OPT2_B: C30.2 IC17.13(D:-IN) IC17.14(D:OUT) OPT2_B.1 R42.2
OPT3: JP1.3 R7.1 U5.3(C)
OPT3_A: C33.2 JP2.3 OPT3_A.1
OPT3_B: C36.2 IC1.6(B:-IN) IC1.7(B:OUT) OPT3_B.1 R49.2
OPT4: JP1.4 R12.1 U6.3(C)
OPT4_A: C37.2 JP2.4 OPT4_A.1
OPT4_B: C40.2 IC1.13(D:-IN) IC1.14(D:OUT) OPT4_B.1 R54.2
OPT5: JP1.5 R17.1 U7.3(C)
OPT5_A: C60.2 JP2.5 OPT5_A.1
OPT5_B: C70.2 IC7.6(B:-IN) IC7.7(B:OUT) OPT5_B.1 R59.2
OPT6: JP1.6 R19.1 U8.3(C)
OPT6_A: C71.2 JP2.6 OPT6_A.1
OPT6_B: C74.2 IC7.13(D:-IN) IC7.14(D:OUT) OPT6_B.1 R65.2
OPT7: JP1.7 R21.1 U9.3(C)
OPT7_A: C75.2 JP2.7 OPT7_A.1
OPT7_B: C78.2 IC8.6(B:-IN) IC8.7(B:OUT) OPT7_B.1 R70.2
OPT8: JP1.8 R25.1 U10.3(C)
OPT8_A: C79.2 JP2.8 OPT8_A.1
OPT8_B: C82.2 IC8.13(D:-IN) IC8.14(D:OUT) OPT8_B.1 R75.2
OPT9: JP1.9 R27.1 U11.3(C)
OPT9_A: C83.2 JP2.9 OPT9_A.1
OPT9_B: C86.2 IC9.6(B:-IN) IC9.7(B:OUT) OPT9_B.1 R85.2
OPT10: JP1.10 R29.1 U12.3(C)
OPT10_A: C87.2 JP2.10 OPT10_A.1
OPT10_B: C90.2 IC9.13(D:-IN) IC9.14(D:OUT) OPT10_B.1 R92.2
OPT11: JP1.11 R31.1 U13.3(C)
OPT11_A: C91.2 JP2.11 OPT11_A.1
OPT11_B: C94.2 IC10.6(B:-IN) IC10.7(B:OUT) OPT11_B.1 R97.2
OPT12: JP1.12 R23.1 U14.3(C)
OPT12_A: C95.2 JP2.12 OPT12_A.1
OPT12_B: C98.2 IC10.13(D:-IN) IC10.14(D:OUT) OPT12_B.1 R102.2
OPT_PWR: C21.1 C22.1 JP1.14 R1.2 R3.2 R7.2 R12.2 R17.2 R19.2 R21.2 R23.2 R25.2 R27.2 R29.2 R31.2 U16.5(IN)
OPT_PWR_EN: JP1.16 U16.4(EN)
OPT_PWR_EN_A: IC3.55(PF15) JP2.16
OPT_PWR_SW: C15.1 C16.1 R2.2 R6.2 R8.2 R16.2 R18.2 R20.2 R22.2 R24.2 R26.2 R28.2 R30.2 R32.2 U16.1(OUT)
OSC1: C17.1 IC3.23(PH0/OSC_IN) Q1.1(X1)
OSC2: C18.1 IC3.24(PH1/OSC_OUT) Q1.3(X2)
PA0: IC3.34(PA0) PA0.1 R37.1
PA1: IC3.35(PA1) PA1.1 R42.1
PA2: IC3.36(PA2) PA2.1 R49.1
PA3: IC3.37(PA3) PA3.1 R54.1
PA4: IC3.40(PA4) PA4.1 R59.1
PA5: IC3.41(PA5) PA5.1 R65.1
PA6: IC3.42(PA6) PA6.1 R70.1
PA7: IC3.43(PA7) PA7.1 R75.1
PA8: IC3.100(PA8)
PA9: IC3.101(PA9)
PA10: IC3.102(PA10)
PA11: IC3.103(PA11)
PA12: IC3.104(PA12)
PB0: IC3.46(PB0) PB0.1 R97.1
PB1: IC3.47(PB1) PB1.1 R102.1
PB5: IC3.135(PB5)
PB6: IC3.136(PB6)
PB7: IC3.137(PB7)
PB8: IC3.139(PB8)
PB9: IC3.140(PB9)
PB12: IC3.73(PB12) J10.2
PB13: IC3.74(PB13) J10.1
PB14: IC3.75(PB14) J10.3
PB15: IC3.76(PB15) J10.4
PC4: IC3.44(PC4) PC4.1 R85.1
PC5: IC3.45(PC5) PC5.1 R92.1
PC6: IC3.96(PC6)
PC7: IC3.97(PC7)
PC14: IC3.8(PC14/OSC32_IN)
PC15: IC3.9(PC15/OSC32_OUT)
PD3: IC3.117(PD3)
PD4: IC3.118(PD4)
PD7: IC3.123(PD7) R107.2
PD11: IC3.80(PD11) R82.2 R86.2 R87.2 R108.2
PD12: IC3.81(PD12)
PD13: IC3.82(PD13)
PF6: IC3.18(PF6)
PF7: IC3.19(PF7)
PF8: IC3.20(PF8)
PF9: IC3.21(PF9)
PF10: IC3.22(PF10)
PG6: IC3.91(PG6)
PG7: IC3.92(PG7)
PG9: IC3.124(PG9) R109.1
PG10: IC3.125(PG10) R106.1
PG11: IC3.126(PG11) R105.1
PG12: IC3.127(PG12)
SAI1_FS_A: R82.1 R83.1
SAI1_MCLK_A: R62.1 R87.1
SAI1_SCK_A: R81.1 R86.1
SAI1_SD_A: R84.1 R108.1
SAI1_SD_B: IC3.2(PE3)
SPI1_CS: JP9.28 JP10.28 JP11.28 JP15.5
SPI1_MISO: JP9.25 JP10.25 JP11.25 JP15.7
SPI1_MISO_OUT: J8.3 R109.2
SPI1_MOSI: JP9.26 JP10.26 JP11.26 JP15.8
SPI1_MOSI_OUT: J8.4 R107.1
SPI1_NSS_OUT: J8.2 R106.2
SPI1_SCK: JP9.18 JP10.18 JP11.18 JP15.6
SPI1_SCK_OUT: J8.1 R105.2
SPI2_CS: JP6.3 JP7.3 JP8.3 JP15.13
SPI2_MISO: JP6.5 JP7.5 JP8.5 JP15.15
SPI2_MOSI: JP6.6 JP7.6 JP8.6 JP15.16
SPI2_SCK: JP6.4 JP7.4 JP8.4 JP15.14
SPI5_CS: JP9.9 JP10.9 JP11.9 JP15.9
SPI5_MISO: JP9.7 JP10.7 JP11.7 JP15.11
SPI5_MOSI: JP9.8 JP10.8 JP11.8 JP15.12
SPI5_SCK: JP9.10 JP10.10 JP11.10 JP15.10
SWCLK: IC3.109(PA14(JTCK/SWCLK)) X2.4
SWD_CK_2: U1.21(P1[1]) X3.4
SWD_IO_2: U1.20(P1[0]) X3.2
SWDIO: IC3.105(PA13(JTMS-SWDIO)) X2.2
SWDRESET: C5.1 IC3.25(!RST) X2.10
SWO: IC3.133(PB3(JTDO/TRACESWO)) X2.6
TOPWIPER1: R113.1 U1.74(P0[3])
TOPWIPER2: U1.73(P0[2]) X7.19
VCAP1: C19.1 IC3.71(VCAP) IC3.106(VCAP)
VCCD0_2: C131.1 C132.1 U1.39(VCCD0) U1.86(VCCD1)
VOUT1: R113.2 U1.71(P0[0])
VOUT2: R114.2 U1.72(P0[1])
VOUT3: R115.2 U1.51(P3[6])
VREF: C64.1 IC3.32(VREF+) R4.2
XRES_2: U1.15(!XRES) X3.10
Unconnected: IC2.1(ON1) IC2.5(OPT) IC2.8(ON2) IC3.7(PC13) IC3.10(PF0) IC3.11(PF1) IC3.12(PF2) IC3.13(PF3) IC3.14(PF4) IC3.15(PF5) IC3.26(PC0) IC3.27(PC1) IC3.28(PC2_C) IC3.29(PC3_C) IC3.48(PB2) IC3.49(PF11) IC3.50(PF12) IC3.53(PF13) IC3.54(PF14) IC3.58(PE7) IC3.59(PE8) IC3.60(PE9) IC3.63(PE10) IC3.64(PE11) IC3.65(PE12) IC3.66(PE13) IC3.67(PE14) IC3.68(PE15) IC3.77(PD8) IC3.78(PD9) IC3.79(PD10) IC3.85(PD14) IC3.86(PD15) IC3.88(PG3) IC3.89(PG4) IC3.90(PG5) IC3.93(PG8) IC3.98(PC8) IC3.99(PC9) IC3.110(PA15(JTDI)) IC3.111(PC10) IC3.112(PC11) IC3.113(PC12) IC3.114(PD0) IC3.115(PD1) IC3.116(PD2) IC3.119(PD5) IC3.122(PD6) IC3.128(PG13) IC3.129(PG14) IC3.132(PG15) IC3.141(PE0) IC3.142(PE1) IC11.3(PG) J1.RING J1.RING-NORM J1.SLEEVE(EARTH) J1.SLEEVE-NORM(EARTH-NORM) J1.TIP J1.TIP-NORM J2.1 J2.2 J2.3 J2.4 J3.1 J3.2 J3.3 J3.4 J4.1 J4.2 J4.3 J4.4 J5.1 J5.2 J5.3 J5.4 J6.1 J6.2 J6.3 J6.4 J7.1 J7.2 J7.3 J7.4 J9.1 J9.2 J9.3 J9.4 J9.5 J9.6 J9.7 J9.8 J13.1 J13.2 J13.3 J13.4 J14.1 J14.2 J14.3 J14.4 J15.A2(SSTXP1) J15.A3(SSTXN1) J15.A8(SBU1) J15.A10(SSRXN2) J15.A11(SSRXP2) J15.B2(SSTXP2) J15.B3(SSTXN2) J15.B8(SBU2) J15.B10(SSRXN1) J15.B11(SSRXP1) JP3.1 JP3.2 JP3.7 JP4.1 JP4.2 JP4.7 JP5.1 JP5.2 JP5.7 JP6.1 JP6.2 JP6.7 JP6.8 JP6.9 JP6.10 JP6.11 JP6.12 JP6.13 JP6.14 JP6.15 JP6.16 JP6.17 JP6.18 JP7.1 JP7.2 JP7.7 JP7.8 JP7.9 JP7.10 JP7.11 JP7.12 JP7.13 JP7.14 JP7.15 JP7.16 JP7.17 JP7.18 JP7.19 JP7.20 JP8.1 JP8.2 JP8.7 JP8.8 JP8.9 JP8.10 JP8.11 JP8.12 JP8.13 JP8.14 JP8.15 JP8.16 JP8.17 JP8.18 JP8.19 JP8.20 JP9.1 JP9.2 JP9.3 JP9.4 JP9.5 JP9.6 JP9.11 JP9.12 JP9.13 JP9.14 JP9.15 JP9.16 JP9.17 JP9.19 JP9.21 JP9.23 JP9.24 JP9.27 JP9.29 JP9.30 JP10.1 JP10.2 JP10.3 JP10.4 JP10.5 JP10.6 JP10.11 JP10.12 JP10.13 JP10.14 JP10.15 JP10.16 JP10.17 JP10.19 JP10.20 JP10.21 JP10.23 JP10.24 JP10.27 JP10.29 JP10.30 JP11.1 JP11.2 JP11.3 JP11.4 JP11.5 JP11.6 JP11.11 JP11.12 JP11.13 JP11.14 JP11.15 JP11.16 JP11.17 JP11.19 JP11.21 JP11.22 JP11.23 JP11.24 JP11.27 JP11.29 JP11.30 JP16.1 JP16.2 JP16.3 JP16.4 JP16.5 JP16.6 JP16.7 JP16.8 JP16.9 JP16.10 JP16.11 JP16.12 JP16.13 JP16.14 JP16.15 JP16.16 S1.1 S1.3 S2.1 S2.3 S3.1 S3.3 S4.1 S4.3 S5.1 S5.3 S6.1 S6.3 S7.1 S7.3 S8.1 S8.3 S9.1 S9.3 S10.1 S10.3 S11.1 S11.3 U1.4(P12[4]) U1.5(P12[5]) U1.11(IND) U1.16(P5[0]) U1.17(P5[1]) U1.18(P5[2]) U1.19(P5[3]) U1.22(P1[2]) U1.23(P1[3]) U1.24(P1[4]) U1.25(P1[5]) U1.27(P1[6]) U1.28(P1[7]) U1.29(P12[6]) U1.30(P12[7]) U1.35(P15[6]) U1.36(P15[7]) U1.42(P15[0]) U1.43(P15[1]) U1.44(P3[0]) U1.47(P3[3]) U1.48(P3[4]) U1.49(P3[5]) U1.52(P3[7]) U1.53(P12[0]) U1.54(P12[1]) U1.55(P15[2]) U1.56(P15[3]) U1.67(P12[2]) U1.68(P12[3]) U1.69(P4[0]) U1.70(P4[1]) U1.76(P0[4]) U1.79(P0[7]) U1.81(P4[3]) U1.82(P4[4]) U1.83(P4[5]) U1.84(P4[6]) U1.85(P4[7]) U1.94(P15[5]) U2.1(P2[5]) U2.2(P2[6]) U2.3(P2[7]) U2.4(P12[4]) U2.5(P12[5]) U2.6(P6[4]) U2.7(P6[5]) U2.8(P6[6]) U2.9(P6[7]) U2.10(VSSB) U2.11(IND) U2.12(VBOOST) U2.13(VBAT) U2.14(VSSD0) U2.15(!XRES) U2.16(P5[0]) U2.17(P5[1]) U2.18(P5[2]) U2.19(P5[3]) U2.20(P1[0]) U2.21(P1[1]) U2.22(P1[2]) U2.23(P1[3]) U2.24(P1[4]) U2.25(P1[5]) U2.26(VDDIO1) U2.27(P1[6]) U2.28(P1[7]) U2.29(P12[6]) U2.30(P12[7]) U2.31(P5[4]) U2.32(P5[5]) U2.33(P5[6]) U2.34(P5[7]) U2.35(P15[6]) U2.36(P15[7]) U2.37(VDDD0) U2.38(VSSD1) U2.39(VCCD0) U2.42(P15[0]) U2.43(P15[1]) U2.44(P3[0]) U2.45(P3[1]) U2.46(P3[2]) U2.47(P3[3]) U2.48(P3[4]) U2.49(P3[5]) U2.50(VDDIO3) U2.51(P3[6]) U2.52(P3[7]) U2.53(P12[0]) U2.54(P12[1]) U2.55(P15[2]) U2.56(P15[3]) U2.63(VCCA) U2.64(VSSA) U2.65(VDDA) U2.66(VSSD2) U2.67(P12[2]) U2.68(P12[3]) U2.69(P4[0]) U2.70(P4[1]) U2.71(P0[0]) U2.72(P0[1]) U2.73(P0[2]) U2.74(P0[3]) U2.75(VDDIO0) U2.76(P0[4]) U2.77(P0[5]) U2.78(P0[6]) U2.79(P0[7]) U2.80(P4[2]) U2.81(P4[3]) U2.82(P4[4]) U2.83(P4[5]) U2.84(P4[6]) U2.85(P4[7]) U2.86(VCCD1) U2.87(VSSD3) U2.88(VDDD1) U2.89(P6[0]) U2.90(P6[1]) U2.91(P6[2]) U2.92(P6[3]) U2.93(P15[4]) U2.94(P15[5]) U2.95(P2[0]) U2.96(P2[1]) U2.97(P2[2]) U2.98(P2[3]) U2.99(P2[4]) U2.100(VDDIO2) U15.GND U15.VIN(IN) U15.VOUT(OUT) U16.3(!OC!) U$1.1-09 U$1.2-09 U$1.3-09 U$2.1-09 U$2.2-09 U$2.3-09 U$5.P$1 U$5.P$2 U$5.P$3 U$5.P$4 U$5.P$5 U$5.P$6 U$5.P$7 U$5.P$8 U$5.P$9(S1) U$5.P$10(S2) U$6.P$1 U$6.P$2 U$6.P$3 U$6.P$4 U$6.P$5 U$6.P$6 U$6.P$7 U$6.P$8 U$6.P$9(S1) U$6.P$10(S2) X1.1 X1.2 X1.3 X1.4 X1.5 X1.6 X1.7 X1.8 X1.9 X1.10 X2.7 X2.8 X3.6 X3.8 X6.1 X6.2 X6.3 X6.4 X6.5 X6.6 X6.7 X6.8 X6.9 X6.10 X6.11 X6.12 X6.13 X6.14 X6.15 X6.16 X6.17 X6.18 X6.19 X6.20 X7.13 X7.14 X7.15 X7.16

## Notes on the sheet
- VR20S05
- lmv611
- LVM614
- lnj426W83RA - 10ma
- 0.05" SWD 10-pin
- don't actually need high current here
- vr20s05
- produce linear +-9v for opamp
- vr20s05
- 10 = 2
- 01 = 1
- 0 0 = 0

## Library data of the parts
3V3A 3V3A_2 3V3D 3V3D2 5V 5VD2 AGND AGND_2 DGND DGND1 DGND3 = adafruit:PINHD-1X1: Pin header 1x1 for 0.1" spacing With round pins; PARTNO: *DNP
5V/1 DGND5 OPT1_A OPT1_B OPT2_A OPT2_B OPT3_A OPT3_B OPT4_A OPT4_B OPT5_A OPT5_B OPT6_A OPT6_B OPT7_A OPT7_B OPT8_A OPT8_B OPT9_A OPT9_B OPT10_A OPT10_B OPT11_A OPT11_B OPT12_A OPT12_B PA0 PA1-PA7 PB0 PB1 PC4 PC5 VREGGND VREGIN = Connector:PINHD-1X1: PIN HEADER; CATEGORY: CONNECTOR; SUB-CATEGORY: PIN-HEADER
C1-C5 C11-C15 C20 C22-C50 C55-C57 C60-C63 C70-C106 C113 C117 C118 C122 C123 = rcl:C-US: CAPACITOR, American symbol; PARTNO: CC0402KRX7R8BB104; SPICEPREFIX: C
C6-C10 C51-C54 C58 C59 C66-C69 C116 C119-C121 = rcl:C-US: CAPACITOR, American symbol; PARTNO: TMK063B7103KP-F; SPICEPREFIX: C
C16 C21 C64 C65 = rcl:C-US: CAPACITOR, American symbol; PARTNO: CC0402KRX7R8BB103; SPICEPREFIX: C
C17 C18 = rcl:C-US: CAPACITOR, American symbol; PARTNO: CL10C180JB8NNNC; SPICEPREFIX: C
C19 = adafruit:C-US: CAPACITOR, American symbol; PARTNO: T491A225K020AT
C107 C110 = rcl:C-US: CAPACITOR, American symbol; PARTNO: CC0603KRX7R8BB104; SPICEPREFIX: C
C108 C111 C114 = rcl:C-US: CAPACITOR, American symbol; PARTNO: C3216X7R1E105K085AA; SPICEPREFIX: C
C109 C112 C115 = rcl:CPOL-US: POLARIZED CAPACITOR, American symbol; PARTNO: TAJB106K025RNJ; SPICEPREFIX: C
C124 C133 C148-C152 C154 C156 C157 = adafruit:C-US: CAPACITOR, American symbol; PARTNO: CC0603KRX7R8BB104
C125 C126 C131 C132 C163 = adafruit:C-US: CAPACITOR, American symbol; PARTNO: C3216X7R1E105K085AA
C153 C160 C161 = rcl:C-EU: CAPACITOR, European symbol; PARTNO: TMK316F106ZL-T
C155 = adafruit:C-US: CAPACITOR, American symbol; PARTNO: C0603C222J5GACTU
D3 = diode:MBRS3*0T3: SCHOTTKY BARRIER RECTIFIER 3.0 AMPERES 20, 30, 40 VOLT Source: MBRS340T3-D.pdf; PARTNO: MBRS340T3G
IC1 IC7-IC10 IC17 = linear:OPA4*: Quad Operational Amplifier compatible with: TLC27L4 Low Power, Single-Supply, Rail-To-Rail Operational Amplifier Source: http://focus.ti.com/lit/ds/symlink/opa2345.pdf http://focus.ti.com .. opa241.pdf http://focus.ti.com .. tlc27l4.pdf http://focus.ti.com/lit/ds/symlink/opa2134.pdf
IC2 = linear:OPA134: AUDIO AMPLIFIER
IC3 = STM32H743ZIT6:STM32H743ZIT6: High-performance and DSP with DP-FPU, ARM Cortex-M7 MCU with 2MBytes Flash, 1MB RAM, 400 MHz CPU, Art Accelerator, L1...; AVAILABILITY: Unavailable; DESCRIPTION: High-performance and DSP with DP-FPU, ARM Cortex-M7 MCU with 2MBytes Flash, 1MB RAM, 400 MHz CPU, Art Accelerator, L1...; MF: STMicroelectronics; MP: STM32H743ZIT6; PACKAGE: LQFP-144 STMicroelectronics; PARTNO: STM32H743ZIT6; PRICE: None
IC4 = linear:LMV321?*: General Purpose, Low Voltage, Rail-to-Rail Output Operational Amplifiers Source: http://www.national.com/mpf/LM/LMV321.html http://www.national.com/dt/lmv_qual.pdf
IC5 = v-reg:78LXX: VOLTAGE REGULATOR
IC6 = v-reg:79LXX: VOLTAGE REGULATOR
IC11 = custom:LP5912; PARTNO: LP5912-3.3DRVT
IC12 = custom:REG1117; PARTNO: LM1117IMPX-3.3/NOPB
IC18 IC20 = custom:REG1117; PARTNO: LD1117S33TR
J1 = SparkFun-Connectors:AUDIO_JACK_TRS_0.25"_PTH_RA: Audio Jack, 1/4" TRS jack, horizontal, PTH, aka "Phono jack" Find the connector here: Audio Jack - 1/4" Stereo (right angle) <https://www.sparkfun.com/products/11144> (COM-11144) Datasheet <http://cdn.sparkfun.com/datasheets/Components/General/JP-611%20DD.jpg> Note, although the datasheet and physical part are slightly different, this footprint was proven to mate well on the Proto Pedal. This device is used on these SparkFun Products: SparkFun TRS Jack Breakout - 1/4" Stereo <https://www.sparkfun.com/products/13005> (BOB-13005 ) SparkFun Proto Pedal - sorry bad link - product comming soon! <https://www.sparkfun.com/products/13124> (PRT-13124); PROD_ID: CONN-12339; SF_ID: COM-11144
J2 = OPL_Connector:GROVE-CONNECTOR-DIP-90D(4P-2.0): 320110034
J3-J8 J10-J14 J16 = OPL_Connector:GROVE-CONNECTOR-DIP(4P-2.0): 320110033
J9 = SparkFun-Connectors:RJ45-8: RJ45 Jack - 8 pin Simple RJ45, 8-pin connection. Commonly used for Cat5, Cat5e, and Cat6 Ethernet cables. Here is the connector we sell at SparkFun: RJ45 8-Pin Connector <https://www.sparkfun.com/products/643> (PRT-00643) Datasheet <https://cdn.sparkfun.com/datasheets/Prototyping/04908.pdf> It is used on this SparkFun product: SparkFun RJ45 Breakout <https://www.sparkfun.com/products/716> (BOB-00716) Note, you may also be interested in the "MAGJACK" version of this. It is basically a RJ45 connector, but also has some status LEDs built into the connector housing. You can check that out in this library at the device named "MAGJACK.dev" and see these products online: RJ45 Ethernet MagJack-Compatible <https://www.sparkfun.com/products/8534> (PRT-08534) SparkFun RJ45 MagJack Breakout <https://www.sparkfun.com/products/13021> (BOB-13021); PROD_ID: CONN-08506; SF_ID: PRT-00643
J15 = UJ31-CH-312-SMT-TR:UJ31-CH-312-SMT-TR: USB 3.1, 2 Point Back Cover, USB Type C Receptacle; MANUFACTURER: CUI INC; PARTNO: UJ31-CH-312-SMT-TR; PART_REV: 1.02; STANDARD: MANUFACTURER RECOMMENDATIONS
JP1 JP2 JP15 JP16 = Connector:PINHD-2X8: PIN HEADER; CATEGORY: CONNECTOR; SUB-CATEGORY: PIN-HEADER
JP3-JP5 = Connector:PINHD-2X4: PIN HEADER; CATEGORY: CONNECTOR; SUB-CATEGORY: PIN-HEADER
JP6-JP8 = Connector:PINHD-2X10: PIN HEADER; CATEGORY: CONNECTOR; SUB-CATEGORY: PIN-HEADER
JP9-JP11 = pinhead:PINHD-2X15: PIN HEADER
JP14 = Connector:PINHD-1X2: PIN HEADER; CATEGORY: CONNECTOR; SUB-CATEGORY: PIN-HEADER
JP40 = pinhead:PINHD-1X4: PIN HEADER; PARTNO: *DNP
LED1 = adafruit:LED: LED OSRAM: - CHIPLED LG R971, LG N971, LY N971, LG Q971, LY Q971, LO R971, LY R971 LH N974, LH R974 LS Q976, LO Q976, LY Q976 LO Q996 - Hyper CHIPLED LW Q18S LB Q993, LB Q99A, LB R99A - SideLED LS A670, LO A670, LY A670, LG A670, LP A670 LB A673, LV A673, LT A673, LW A673 LH A674 LY A675 LS A676, LA A676, LO A676, LY A676, LW A676 LS A679, LY A679, LG A679 - Hyper Micro SIDELED® LS Y876, LA Y876, LO Y876, LY Y876 LT Y87S - SmartLED LW L88C, LW L88S LB L89C, LB L89S, LG L890 LS L89K, LO L89K, LY L89K LS L896, LA L896, LO L896, LY L896 - TOPLED LS T670, LO T670, LY T670, LG T670, LP T670 LSG T670, LSP T670, LSY T670, LOP T670, LYG T670 LG T671, LOG T671, LSG T671 LB T673, LV T673, LT T673, LW T673 LH T674 LS T676, LA T676, LO T676, LY T676, LB T676, LH T676, LSB T676, LW T676 LB T67C, LV T67C, LT T67C, LS T67K, LO T67K, LY T67K, LW E67C LS E67B, LA E67B, LO E67B, LY E67B, LB E67C, LV E67C, LT E67C LW T67C LS T679, LY T679, LG T679 LS T770, LO T770, LY T770, LG T770, LP T770 LB T773, LV T773, LT T773, LW T773 LH T774 LS E675, LA E675, LY E675, LS T675 LS T776, LA T776, LO T776, LY T776, LB T776 LHGB T686 LT T68C, LB T68C - Hyper Mini TOPLED® LB M676 - Mini TOPLED Santana® LG M470 LS M47K, LO M47K, LY M47K Source: http://www.osram.convergy.de/; PARTNO: 5973006507F
LED2 = adafruit:LED: LED OSRAM: - CHIPLED LG R971, LG N971, LY N971, LG Q971, LY Q971, LO R971, LY R971 LH N974, LH R974 LS Q976, LO Q976, LY Q976 LO Q996 - Hyper CHIPLED LW Q18S LB Q993, LB Q99A, LB R99A - SideLED LS A670, LO A670, LY A670, LG A670, LP A670 LB A673, LV A673, LT A673, LW A673 LH A674 LY A675 LS A676, LA A676, LO A676, LY A676, LW A676 LS A679, LY A679, LG A679 - Hyper Micro SIDELED® LS Y876, LA Y876, LO Y876, LY Y876 LT Y87S - SmartLED LW L88C, LW L88S LB L89C, LB L89S, LG L890 LS L89K, LO L89K, LY L89K LS L896, LA L896, LO L896, LY L896 - TOPLED LS T670, LO T670, LY T670, LG T670, LP T670 LSG T670, LSP T670, LSY T670, LOP T670, LYG T670 LG T671, LOG T671, LSG T671 LB T673, LV T673, LT T673, LW T673 LH T674 LS T676, LA T676, LO T676, LY T676, LB T676, LH T676, LSB T676, LW T676 LB T67C, LV T67C, LT T67C, LS T67K, LO T67K, LY T67K, LW E67C LS E67B, LA E67B, LO E67B, LY E67B, LB E67C, LV E67C, LT E67C LW T67C LS T679, LY T679, LG T679 LS T770, LO T770, LY T770, LG T770, LP T770 LB T773, LV T773, LT T773, LW T773 LH T774 LS E675, LA E675, LY E675, LS T675 LS T776, LA T776, LO T776, LY T776, LB T776 LHGB T686 LT T68C, LB T68C - Hyper Mini TOPLED® LB M676 - Mini TOPLED Santana® LG M470 LS M47K, LO M47K, LY M47K Source: http://www.osram.convergy.de/; PARTNO: 5973506507F
Q1 = adafruit:XTAL-4: Classic 4-pin 3.2 x 2.5mm crystal; PARTNO: 7M-25.000MAAJ-T
R1-R3 R6-R8 R12 R16-R32 = Resistor:R-US: Resistor Fixed - ANSI; CATEGORY: Resistor; SUB-CATEGORY: Fixed
R4 R113-R115 = Resistor:R-US_: RESISTOR, American symbol; PARTNO: ESR03EZPJ470
R5 = Resistor:R-US_: RESISTOR, American symbol; PARTNO: RC0402FR-0710KL
R9-R11 R13 R33-R61 R63-R80 R85 R88-R102 R104 = Resistor:R-US_: RESISTOR, American symbol; PARTNO: ESR03EZPF5600
R14 R15 R82 R86 R87 R103 R108 R110-R112 = Resistor:R-US_: RESISTOR, American symbol; PARTNO: RCS06030000Z0EA
R62 R81 R83 R84 = rcl:R-US_: RESISTOR, American symbol; PARTNO: RC0201FR-0733RL; SPICEPREFIX: R
R105-R107 R109 = Resistor:R-US_: RESISTOR, American symbol; PARTNO: RC0402FR-0733RL
R128 R129 = adafruit:R-US_: RESISTOR, American symbol; PARTNO: ERJ-3EKF5101V
S1-S11 = SparkFun-Switches:MOMENTARY-SWITCH-SPST: Momentary Switch (Pushbutton) - SPST Normally-open (NO) SPST momentary switches (buttons, pushbuttons). Variants PTH-12MM - 12mm square, through-hole Momentary Pushbutton Switch - 12mm Square <https://www.sparkfun.com/products/9190> (COM-09190) PTH-6.0MM, PTH-6.0MM-KIT - 6.0mm square, through-hole Mini Pushbutton Switch <https://www.sparkfun.com/products/97> (COM-00097) KIT package intended for soldering kit's - only one side of pads' copper is exposed. PTH-RIGHT-ANGLE-KIT - Right-angle, through-hole Right Angle Tactile Button <https://www.sparkfun.com/products/10791> - Used on SparkFun BigTime Watch Kit <https://www.sparkfun.com/products/11734> SMD-12MM - 12mm square, surface-mount Tactile Button - SMD (12mm) <https://www.sparkfun.com/products/12993> (COM-12993) Used on SparkFun PicoBoard <https://www.sparkfun.com/products/11888> SMD-4.5MM - 4.5mm Square Trackball Switch Used on SparkFun Blackberry Trackballer Breakout <https://www.sparkfun.com/products/13169> SMD-4.6MMX2.8MM - 4.60mm x 2.80mm, surface mount Used on SparkFun SAMD21 Mini Breakout <https://www.sparkfun.com/products/13664> SMD-5.2MM, SMD-5.2-REDUNDANT - 5.2mm square, surface-mount Mini Pushbutton Switch - SMD <https://www.sparkfun.com/products/8720> (COM-08720) Used on Arduino Pro Mini <https://www.sparkfun.com/products/11114> REDUNDANT package connects both switch circuits together SMD-6.0X3.5MM - 6.0 x 3.5mm, surface mount Momentary Reset Switch SMD <https://www.sparkfun.com/products/8229> (COM-08229) SMD-6.2MM-TALL - 6.2mm square, surface mount Tactile Button - SMD (6mm) <https://www.sparkfun.com/products/12992> Used on SparkFun Digital Sandbox <https://www.sparkfun.com/products/12651> SMD-RIGHT-ANGLE - Right-angle, surface mount Used on SparkFun Block for Intel® Edison - Arduino <https://www.sparkfun.com/products/13036>; PROD_ID: SWCH-08441; SF_SKU: COM-00097
U1 U2 = SparkFun-IC-Microcontroller:PSOC_5LP_100QFP: Cypress PSOC 5LP, 100-pin package We use the CY8C5868AXI-LP035, which has the "full" feature set: - 256k flash - 64k SRAM - 2k EEPROM - CAN - Full-speed USB - 67MHz operation Datasheet SparkFun Products FreeSoC2 Development Board - PSoC5LP <https://www.sparkfun.com/products/13229> (DEV-13229) -- Involved with change to new unposted revision; PROD_ID: IC-12190
U3-U14 = SparkFun-Sensors:QRE1113: QRE1113 Reflective Object Sensor The QRE1113 is a small IR reflectance sensor. This sensor is often used in line following robots because, if it can sense if a surface is white or black. There are four pins on the QRE1113 - two control the IR emitting LED while the other two are the collector and emitter of a phototransistor. The IR diode has a max forward current of 50mA and operates at 940nm. Datasheet <http://www.sparkfun.com/datasheets/Components/SMD/QRE1113.GR.pdf> SparkFun Products IR Reflectance Sensor - QRE1113 <https://www.sparkfun.com/products/9542> (COM-09542) SparkFun Line Sensor Breakout - QRE1113 (Analog) <https://www.sparkfun.com/products/9453> (ROB-09453) SparkFun Line Sensor Breakout - QRE1113 (Digital) <https://www.sparkfun.com/products/9454> (ROB-09454) SparkFun RedBot Sensor - Line Follower <https://www.sparkfun.com/products/11769> (SEN-11769) SparkFun RedBot Sensor - Wheel Encoder <https://www.sparkfun.com/products/12617> (SEN-12617) SparkFun Line Follower Array <https://www.sparkfun.com/products/13582> (SEN-13582); PROD_ID: IC-09357; SF_ID: COM-09542
U15 U17 U18 = SparkFun-IC-Power:R-78E5.0-1.0: Recom Power 5V 1A DC/DC Converter The Recom R-78E5.0-X.X is a compact DC/DC converter module that is a pin for pin drop-in replacement for the LM7805 linear voltage regulator. Specifications: Input Range: 7-28V Output Voltage: 5V Output Current: 1A Max Efficiency: 91% Datasheet <https://www.recom-power.com/pdf/Innoline/R-78Exx-1.0.pdf>; PROD_ID: COM-13655
U16 = LinkedLibrary52101:TEXAS_TPS2051B: POWER-DISTRIBUTION SWITCH
U$1 U$2 = custom:RK09
U$3 = custom:CMR0512S3C
U$5 U$6 = custom:SS-7188VS-A-FLS
X1-X3 = custom:3221-10-0300-00; PARTNO: 4048
X6 X7 = con-3m:2520-: 3M (TM) Pak 100 4-Wall Header Source: 3M; OC_FARNELL: unknown; OC_NEWARK: unknown